# EAGLE schematic aleph-130509 (EAGLE 6.4)

## Sheet 1 of 9
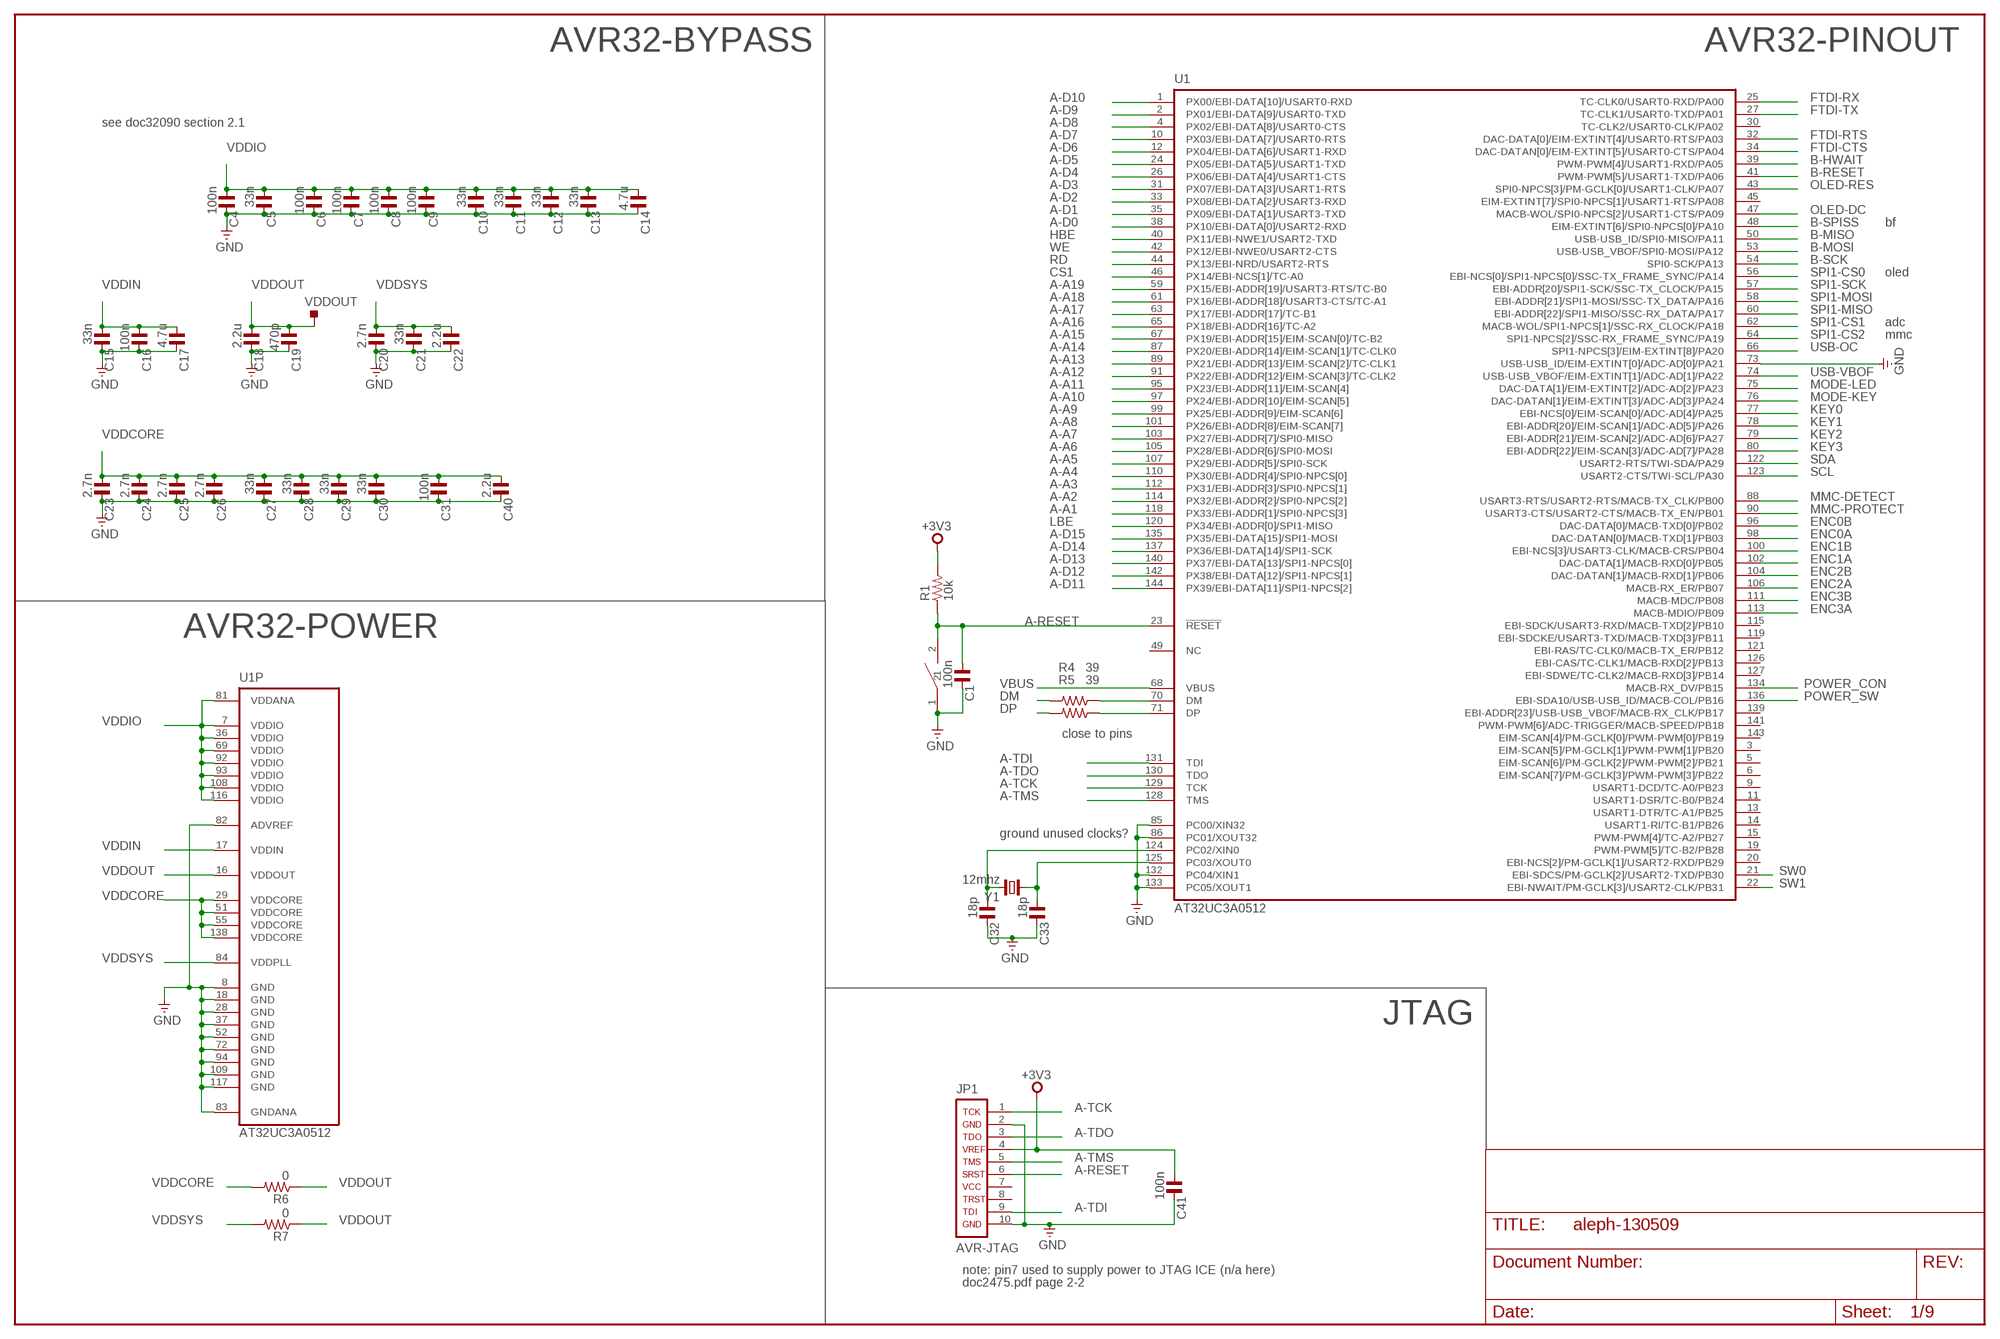
[diagram p0: schematic, sheet 1]

### Parts
C1  100n  C_0603  [C0603]
C4  100n  C_0603  [C0603]
C5  33n  C_0603  [C0603]
C6  100n  C_0603  [C0603]
C7  100n  C_0603  [C0603]
C8  100n  C_0603  [C0603]
C9  100n  C_0603  [C0603]
C10  33n  C_0603  [C0603]
C11  33n  C_0603  [C0603]
C12  33n  C_0603  [C0603]
C13  33n  C_0603  [C0603]
C14  4.7u  C_1206  [C1206]
C15  33n  C_0603  [C0603]
C16  100n  C_0603  [C0603]
C17  4.7u  C_1206  [C1206]
C18  2.2u  C_1206  [C1206]
C19  470p  C_0603  [C0603]
C20  2.7n  C_0603  [C0603]
C21  33n  C_0603  [C0603]
C22  2.2u  C_1206  [C1206]
C23  2.7n  C_0603  [C0603]
C24  2.7n  C_0603  [C0603]
C25  2.7n  C_0603  [C0603]
C26  2.7n  C_0603  [C0603]
C27  33n  C_0603  [C0603]
C28  33n  C_0603  [C0603]
C29  33n  C_0603  [C0603]
C30  33n  C_0603  [C0603]
C31  100n  C_0603  [C0603]
C32  18p  C_0603  [C0603]
C33  18p  C_0603  [C0603]
C40  2.2u  C_1206  [C1206]
C41  100n  C_0603  [C0603]
JP1  AVR-JTAG  AVR-JTAG-10  [AVR-JTAG-10]
R1  10k  R_0603  [R0603]
R4  39  R_0603  [R0603]
R5  39  R_0603  [R0603]
R6  0  R_0603  [R0603]
R7  0  R_0603  [R0603]
U1  AT32UC3A0512  AT32UC3A0128/0256/0512  [LQFP144]
U$1  PANASONIC-EVQ  [PANASONIC-EVQ]
VDDOUT  TPS-SMD-10R  [SMD-10R]
Y1  12mhz  CRYTALHC49UP  [HC49UP]

### Nets
+3V3: C41.1 JP1.4 R1.2 ; also sheet 2,3
A-A1: U1.118(PX33/EBI-ADDR[1]/SPI0-NPCS[3]) ; also sheet 2
A-A2: U1.114(PX32/EBI-ADDR[2]/SPI0-NPCS[2]) ; also sheet 2
A-A3: U1.112(PX31/EBI-ADDR[3]/SPI0-NPCS[1]) ; also sheet 2
A-A4: U1.110(PX30/EBI-ADDR[4]/SPI0-NPCS[0]) ; also sheet 2
A-A5: U1.107(PX29/EBI-ADDR[5]/SPI0-SCK) ; also sheet 2
A-A6: U1.105(PX28/EBI-ADDR[6]/SPI0-MOSI) ; also sheet 2
A-A7: U1.103(PX27/EBI-ADDR[7]/SPI0-MISO) ; also sheet 2
A-A8: U1.101(PX26/EBI-ADDR[8]/EIM-SCAN[7]) ; also sheet 2
A-A9: U1.99(PX25/EBI-ADDR[9]/EIM-SCAN[6]) ; also sheet 2
A-A10: U1.97(PX24/EBI-ADDR[10]/EIM-SCAN[5]) ; also sheet 2
A-A11: U1.95(PX23/EBI-ADDR[11]/EIM-SCAN[4]) ; also sheet 2
A-A12: U1.91(PX22/EBI-ADDR[12]/EIM-SCAN[3]/TC-CLK2) ; also sheet 2
A-A13: U1.89(PX21/EBI-ADDR[13]/EIM-SCAN[2]/TC-CLK1) ; also sheet 2
A-A14: U1.87(PX20/EBI-ADDR[14]/EIM-SCAN[1]/TC-CLK0) ; also sheet 2
A-A15: U1.67(PX19/EBI-ADDR[15]/EIM-SCAN[0]/TC-B2) ; also sheet 2
A-A16: U1.65(PX18/EBI-ADDR[16]/TC-A2) ; also sheet 2
A-A17: U1.63(PX17/EBI-ADDR[17]/TC-B1) ; also sheet 2
A-A18: U1.61(PX16/EBI-ADDR[18]/USART3-CTS/TC-A1) ; also sheet 2
A-A19: U1.59(PX15/EBI-ADDR[19]/USART3-RTS/TC-B0) ; also sheet 2
A-D0: U1.38(PX10/EBI-DATA[0]/USART2-RXD) ; also sheet 2
A-D1: U1.35(PX09/EBI-DATA[1]/USART3-TXD) ; also sheet 2
A-D2: U1.33(PX08/EBI-DATA[2]/USART3-RXD) ; also sheet 2
A-D3: U1.31(PX07/EBI-DATA[3]/USART1-RTS) ; also sheet 2
A-D4: U1.26(PX06/EBI-DATA[4]/USART1-CTS) ; also sheet 2
A-D5: U1.24(PX05/EBI-DATA[5]/USART1-TXD) ; also sheet 2
A-D6: U1.12(PX04/EBI-DATA[6]/USART1-RXD) ; also sheet 2
A-D7: U1.10(PX03/EBI-DATA[7]/USART0-RTS) ; also sheet 2
A-D8: U1.4(PX02/EBI-DATA[8]/USART0-CTS) ; also sheet 2
A-D9: U1.2(PX01/EBI-DATA[9]/USART0-TXD) ; also sheet 2
A-D10: U1.1(PX00/EBI-DATA[10]/USART0-RXD) ; also sheet 2
A-D11: U1.144(PX39/EBI-DATA[11]/SPI1-NPCS[2]) ; also sheet 2
A-D12: U1.142(PX38/EBI-DATA[12]/SPI1-NPCS[1]) ; also sheet 2
A-D13: U1.140(PX37/EBI-DATA[13]/SPI1-NPCS[0]) ; also sheet 2
A-D14: U1.137(PX36/EBI-DATA[14]/SPI1-SCK) ; also sheet 2
A-D15: U1.135(PX35/EBI-DATA[15]/SPI1-MOSI) ; also sheet 2
A-RESET: C1.1 JP1.6 R1.1 U1.23(!RESET) U$1.2
A-TCK: JP1.1 U1.129(TCK)
A-TDI: JP1.9 U1.131(TDI)
A-TDO: JP1.3 U1.130(TDO)
A-TMS: JP1.5 U1.128(TMS)
B-HWAIT: U1.39(PWM-PWM[4]/USART1-RXD/PA05) ; also sheet 4
B-MISO: U1.50(USB-USB_ID/SPI0-MISO/PA11) ; also sheet 4
B-MOSI: U1.53(USB-USB_VBOF/SPI0-MOSI/PA12) ; also sheet 4
B-RESET: U1.41(PWM-PWM[5]/USART1-TXD/PA06) ; also sheet 4
B-SCK: U1.54(SPI0-SCK/PA13) ; also sheet 4
B-SPISS: U1.48(EIM-EXTINT[6]/SPI0-NPCS[0]/PA10) ; also sheet 4
CS1: U1.46(PX14/EBI-NCS[1]/TC-A0) ; also sheet 2
DM: R4.2 ; also sheet 2
DP: R5.2 ; also sheet 2
ENC0A: U1.98(DAC-DATAN[0]/MACB-TXD[1]/PB03) ; also sheet 3
ENC0B: U1.96(DAC-DATA[0]/MACB-TXD[0]/PB02) ; also sheet 3
ENC1A: U1.102(DAC-DATA[1]/MACB-RXD[0]/PB05) ; also sheet 3
ENC1B: U1.100(EBI-NCS[3]/USART3-CLK/MACB-CRS/PB04) ; also sheet 3
ENC2A: U1.106(MACB-RX_ER/PB07) ; also sheet 3
ENC2B: U1.104(DAC-DATAN[1]/MACB-RXD[1]/PB06) ; also sheet 3
ENC3A: U1.113(MACB-MDIO/PB09) ; also sheet 3
ENC3B: U1.111(MACB-MDC/PB08) ; also sheet 3
FTDI-CTS: U1.34(DAC-DATAN[0]/EIM-EXTINT[5]/USART0-CTS/PA04) ; also sheet 2
FTDI-RTS: U1.32(DAC-DATA[0]/EIM-EXTINT[4]/USART0-RTS/PA03) ; also sheet 2
FTDI-RX: U1.25(TC-CLK0/USART0-RXD/PA00) ; also sheet 2
FTDI-TX: U1.27(TC-CLK1/USART0-TXD/PA01) ; also sheet 2
GND: C1.2 C4.2 C5.2 C6.2 C7.2 C8.2 C9.2 C10.2 C11.2 C12.2 C13.2 C14.2 C15.2 C16.2 C17.2 C18.2 C19.2 C20.2 C21.2 C22.2 C23.2 C24.2 C25.2 C26.2 C27.2 C28.2 C29.2 C30.2 C31.2 C32.2 C33.2 C40.2 C41.2 JP1.2 JP1.10 U1.8(GND) U1.18(GND) U1.28(GND) U1.37(GND) U1.52(GND) U1.72(GND) U1.73(USB-USB_ID/EIM-EXTINT[0]/ADC-AD[0]/PA21) U1.82(ADVREF) U1.83(GNDANA) U1.85(PC00/XIN32) U1.86(PC01/XOUT32) U1.94(GND) U1.109(GND) U1.117(GND) U1.132(PC04/XIN1) U1.133(PC05/XOUT1) U$1.1 ; also sheet 2,3,4,5
HBE: U1.40(PX11/EBI-NWE1/USART2-TXD) ; also sheet 2
KEY0: U1.77(EBI-NCS[0]/EIM-SCAN[0]/ADC-AD[4]/PA25) ; also sheet 3
KEY1: U1.78(EBI-ADDR[20]/EIM-SCAN[1]/ADC-AD[5]/PA26) ; also sheet 3
KEY2: U1.79(EBI-ADDR[21]/EIM-SCAN[2]/ADC-AD[6]/PA27) ; also sheet 3
KEY3: U1.80(EBI-ADDR[22]/EIM-SCAN[3]/ADC-AD[7]/PA28) ; also sheet 3
LBE: U1.120(PX34/EBI-ADDR[0]/SPI1-MISO) ; also sheet 2
MMC-DETECT: U1.88(USART3-RTS/USART2-RTS/MACB-TX_CLK/PB00) ; also sheet 2
MMC-PROTECT: U1.90(USART3-CTS/USART2-CTS/MACB-TX_EN/PB01) ; also sheet 2
MODE-KEY: U1.76(DAC-DATAN[1]/EIM-EXTINT[3]/ADC-AD[3]/PA24) ; also sheet 3
MODE-LED: U1.75(DAC-DATA[1]/EIM-EXTINT[2]/ADC-AD[2]/PA23) ; also sheet 3
N$4: C32.1 U1.124(PC02/XIN0) Y1.2
N$5: C33.1 U1.125(PC03/XOUT0) Y1.1
N$44: R4.1 U1.70(DM)
N$45: R5.1 U1.71(DP)
OLED-DC: U1.47(MACB-WOL/SPI0-NPCS[2]/USART1-CTS/PA09) ; also sheet 3
OLED-RES: U1.43(SPI0-NPCS[3]/PM-GCLK[0]/USART1-CLK/PA07) ; also sheet 3
POWER_CON: U1.134(MACB-RX_DV/PB15) ; also sheet 2
POWER_SW: U1.136(EBI-SDA10/USB-USB_ID/MACB-COL/PB16) ; also sheet 2
RD: U1.44(PX13/EBI-NRD/USART2-RTS) ; also sheet 2
SCL: U1.123(USART2-CTS/TWI-SCL/PA30) ; also sheet 3
SDA: U1.122(USART2-RTS/TWI-SDA/PA29) ; also sheet 3
SPI1-CS0: U1.56(EBI-NCS[0]/SPI1-NPCS[0]/SSC-TX_FRAME_SYNC/PA14) ; also sheet 3
SPI1-CS1: U1.62(MACB-WOL/SPI1-NPCS[1]/SSC-RX_CLOCK/PA18) ; also sheet 3
SPI1-CS2: U1.64(SPI1-NPCS[2]/SSC-RX_FRAME_SYNC/PA19) ; also sheet 2
SPI1-MISO: U1.60(EBI-ADDR[22]/SPI1-MISO/SSC-RX_DATA/PA17) ; also sheet 2,3
SPI1-MOSI: U1.58(EBI-ADDR[21]/SPI1-MOSI/SSC-TX_DATA/PA16) ; also sheet 2,3
SPI1-SCK: U1.57(EBI-ADDR[20]/SPI1-SCK/SSC-TX_CLOCK/PA15) ; also sheet 2,3
SW0: U1.21(EBI-SDCS/PM-GCLK[2]/USART2-TXD/PB30) ; also sheet 3
SW1: U1.22(EBI-NWAIT/PM-GCLK[3]/USART2-CLK/PB31) ; also sheet 3
USB-OC: U1.66(SPI1-NPCS[3]/EIM-EXTINT[8]/PA20) ; also sheet 2
USB-VBOF: U1.74(USB-USB_VBOF/EIM-EXTINT[1]/ADC-AD[1]/PA22) ; also sheet 2
VBUS: U1.68(VBUS) ; also sheet 2
VDDCORE: C23.1 C24.1 C25.1 C26.1 C27.1 C28.1 C29.1 C30.1 C31.1 C40.1 R6.2 U1.29(VDDCORE) U1.51(VDDCORE) U1.55(VDDCORE) U1.138(VDDCORE)
VDDIN: C15.1 C16.1 C17.1 U1.17(VDDIN) ; also sheet 2
VDDIO: C4.1 C5.1 C6.1 C7.1 C8.1 C9.1 C10.1 C11.1 C12.1 C13.1 C14.1 U1.7(VDDIO) U1.36(VDDIO) U1.69(VDDIO) U1.81(VDDANA) U1.92(VDDIO) U1.93(VDDIO) U1.108(VDDIO) U1.116(VDDIO) ; also sheet 2
VDDOUT: C18.1 C19.1 R6.1 R7.1 U1.16(VDDOUT) VDDOUT.TP
VDDSYS: C20.1 C21.1 C22.1 R7.2 U1.84(VDDPLL)
WE: U1.42(PX12/EBI-NWE0/USART2-CTS) ; also sheet 2
Unconnected: JP1.7 JP1.8 U1.3(EIM-SCAN[5]/PM-GCLK[1]/PWM-PWM[1]/PB20) U1.5(EIM-SCAN[6]/PM-GCLK[2]/PWM-PWM[2]/PB21) U1.6(EIM-SCAN[7]/PM-GCLK[3]/PWM-PWM[3]/PB22) U1.9(USART1-DCD/TC-A0/PB23) U1.11(USART1-DSR/TC-B0/PB24) U1.13(USART1-DTR/TC-A1/PB25) U1.14(USART1-RI/TC-B1/PB26) U1.15(PWM-PWM[4]/TC-A2/PB27) U1.19(PWM-PWM[5]/TC-B2/PB28) U1.20(EBI-NCS[2]/PM-GCLK[1]/USART2-RXD/PB29) U1.30(TC-CLK2/USART0-CLK/PA02) U1.45(EIM-EXTINT[7]/SPI0-NPCS[1]/USART1-RTS/PA08) U1.49(NC) U1.115(EBI-SDCK/USART3-RXD/MACB-TXD[2]/PB10) U1.119(EBI-SDCKE/USART3-TXD/MACB-TXD[3]/PB11) U1.121(EBI-RAS/TC-CLK0/MACB-TX_ER/PB12) U1.126(EBI-CAS/TC-CLK1/MACB-RXD[2]/PB13) U1.127(EBI-SDWE/TC-CLK2/MACB-RXD[3]/PB14) U1.139(EBI-ADDR[23]/USB-USB_VBOF/MACB-RX_CLK/PB17) U1.141(PWM-PWM[6]/ADC-TRIGGER/MACB-SPEED/PB18) U1.143(EIM-SCAN[4]/PM-GCLK[0]/PWM-PWM[0]/PB19)

### Notes on the sheet
- AVR32-BYPASS | AVR32-PINOUT
- see doc32090 section 2.1
- bf
- oled
- adc
- mmc
- AVR32-POWER
- close to pins
- ground unused clocks?
- JTAG
- note: pin7 used to supply power to JTAG ICE (n/a here)
- doc2475.pdf page 2-2

## Sheet 2 of 9
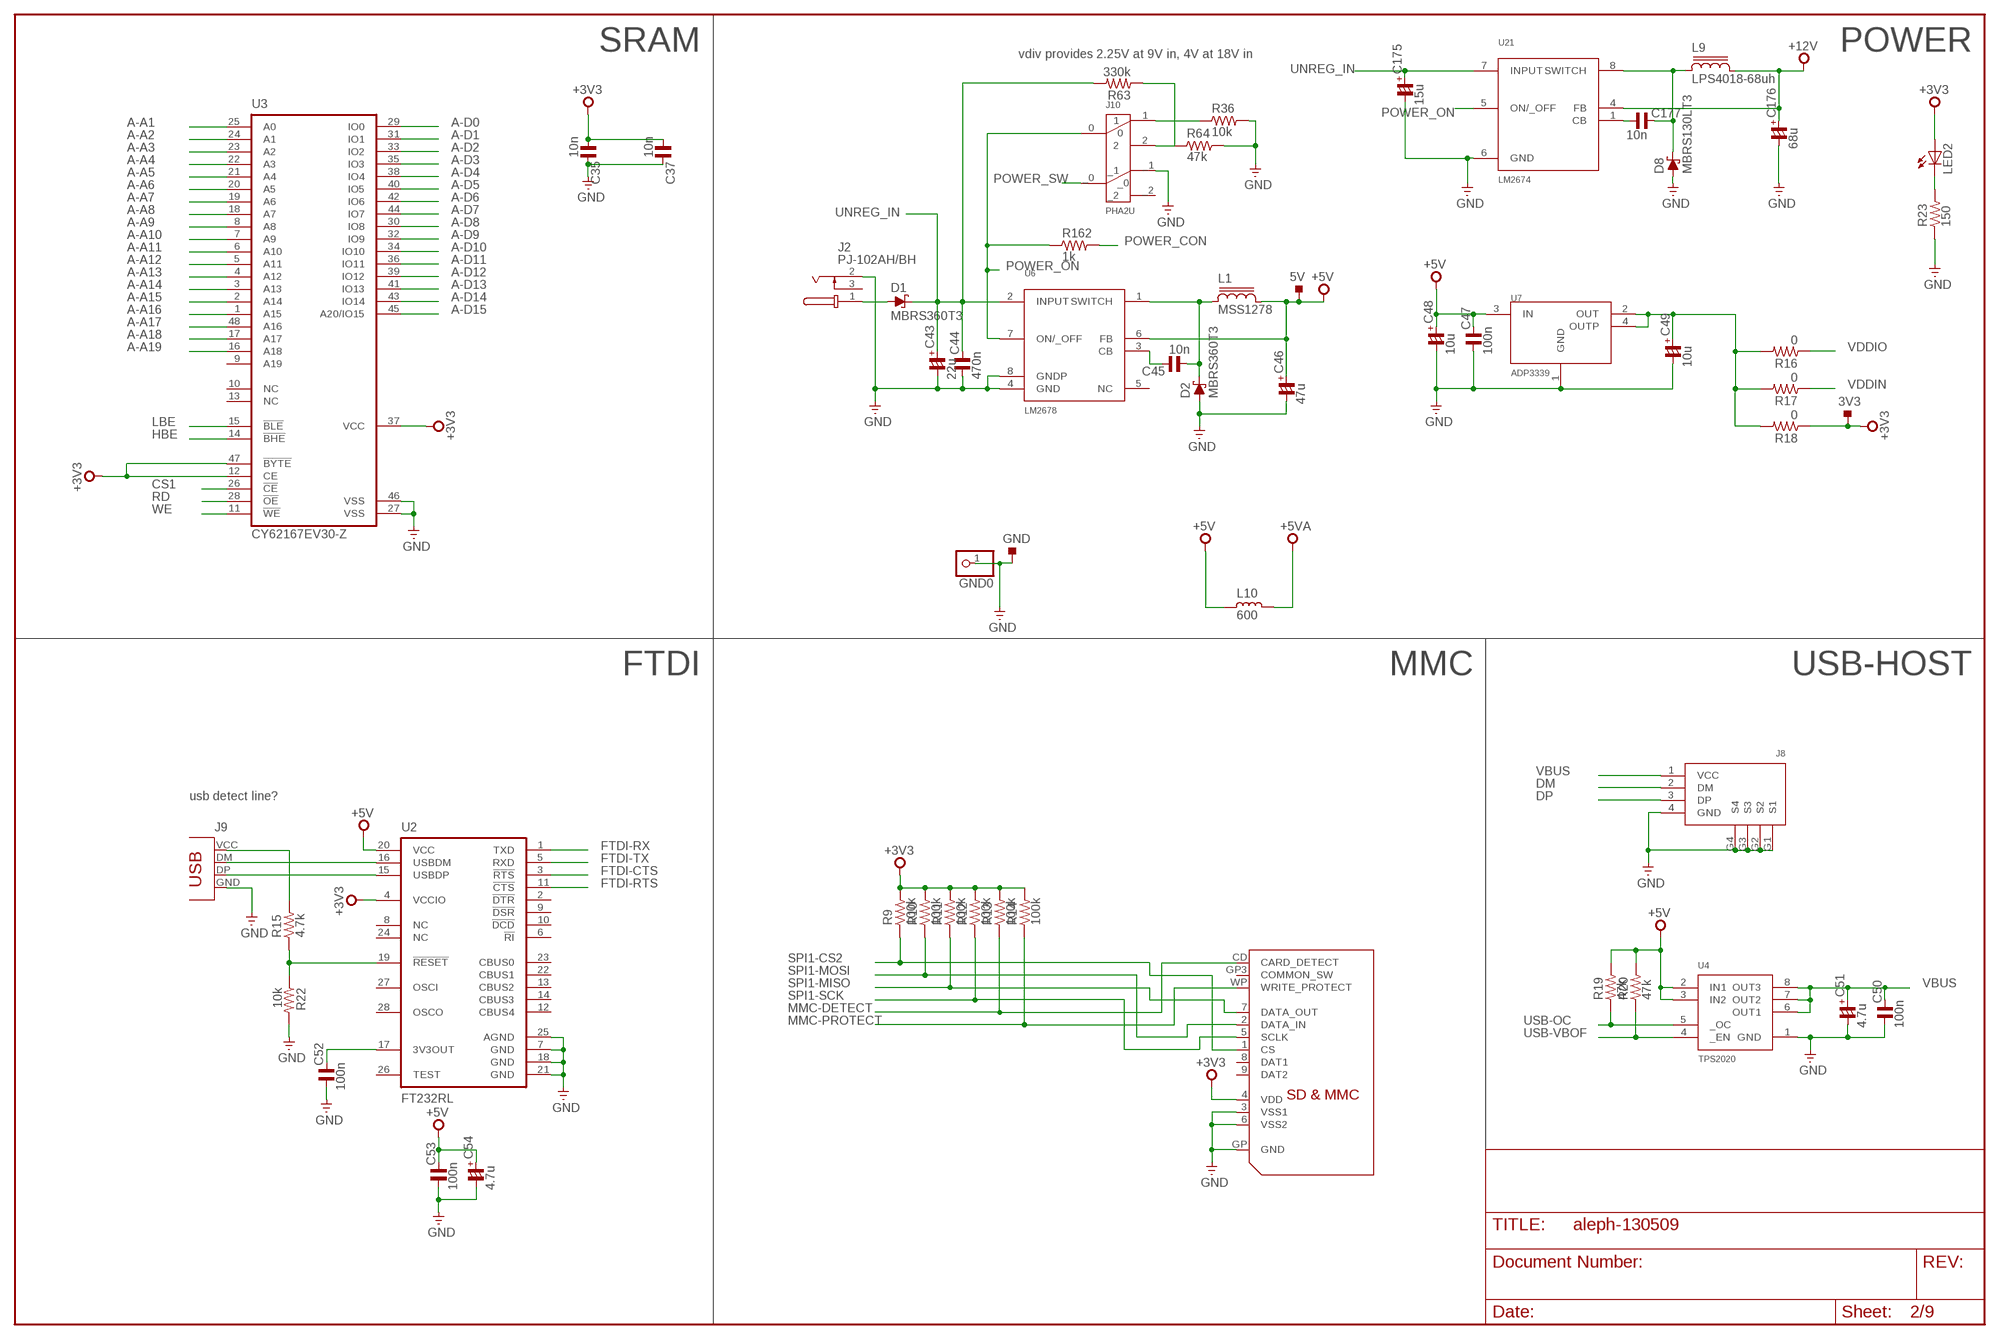
[diagram p1: schematic, sheet 2]

### Parts
3V3  TPS-SMD-15R  [SMD-15R]
5V  TPS-SMD-15R  [SMD-15R]
C35  10n  C_0603  [C0603]
C37  10n  C_0603  [C0603]
C43  22u  CP_1206/T  [C1206/T]
C44  470n  C_1206  [C1206]
C45  10n  C_1206  [C1206]
C46  47u  CP_3528  [C3528/T]
C47  100n  C_1206  [C1206]
C48  10u  CP_1206/T  [C1206/T]
C49  10u  CP_1206/T  [C1206/T]
C50  100n  C_0603  [C0603]
C51  4.7u  CP_1206/T  [C1206/T]
C52  100n  C_0603  [C0603]
C53  100n  C_0603  [C0603]
C54  4.7u  CP_1206/T  [C1206/T]
C175  15u  CP_6032  [C6032/T]
C176  68u  CP_7343  [C7343/T]
C177  10n  C_0603  [C0603]
D1  MBRS360T3  [SMC]
D2  MBRS360T3  [SMC]
D8  MBRS130LT3  [SMB403A]
GND  TPS-SMD-20R  [SMD-20R]
GND0  PINHD-1X1  [1X01]
J2  PJ-102AH/BH  [PJ-102XH]
J8  USBA-VERT  [USBA-VERT]
J9  USB_TYPE_B  [USB_B]
J10  PHA2U  [PHA2U]
L1  MSS1278  [MSS1278]
L9  LPS4018-68uh  LPS4018  [LPS4018]
L10  600  L_1206  [L1206]
LED2  LEDCHIPLED_1206  [CHIPLED_1206]
R9  100k  R_0603  [R0603]
R10  100k  R_0603  [R0603]
R11  100k  R_0603  [R0603]
R12  100k  R_0603  [R0603]
R13  100k  R_0603  [R0603]
R14  100k  R_0603  [R0603]
R15  4.7k  R_0603  [R0603]
R16  0  R_0603  [R0603]
R17  0  R_0603  [R0603]
R18  0  R_0603  [R0603]
R19  47k  R_0603  [R0603]
R20  47k  R_0603  [R0603]
R22  10k  R_0603  [R0603]
R23  150  R_0603  [R0603]
R36  10k  R_0603  [R0603]
R63  330k  R_0603  [R0603]
R64  47k  R_0603  [R0603]
R162  1k  R_0603  [R0603]
U2  FT232RL  [SSOP28]
U3  CY62167EV30-Z  [TSOP48]
U4  TPS2020  [SO08]
U6  LM2678  [TO263-7]
U7  ADP3339  [SOT223]
U21  LM2674  [SO08]
U$6  SDMMC06132  [06132]

### Nets
+3V3: 3V3.TP C35.1 C37.1 LED2.A R9.2 R10.2 R11.2 R12.2 R13.2 R14.2 R18.1 U2.4(VCCIO) U3.12(CE) U3.37(VCC) U3.47(!BYTE!) U$6.4(VDD) ; also sheet 1,3
+5V: 5V.TP C46.+ C47.2 C48.+ C53.2 C54.+ L1.2 L10.2 R19.2 R20.2 U2.20(VCC) U4.2(IN1) U4.3(IN2) U6.6(FB) U7.3(IN) ; also sheet 3,4,6
+5VA: L10.1 ; also sheet 3,7,9
+12V: C176.+ L9.2 U21.4(FB) ; also sheet 3,6
A-A1: U3.25(A0) ; also sheet 1
A-A2: U3.24(A1) ; also sheet 1
A-A3: U3.23(A2) ; also sheet 1
A-A4: U3.22(A3) ; also sheet 1
A-A5: U3.21(A4) ; also sheet 1
A-A6: U3.20(A5) ; also sheet 1
A-A7: U3.19(A6) ; also sheet 1
A-A8: U3.18(A7) ; also sheet 1
A-A9: U3.8(A8) ; also sheet 1
A-A10: U3.7(A9) ; also sheet 1
A-A11: U3.6(A10) ; also sheet 1
A-A12: U3.5(A11) ; also sheet 1
A-A13: U3.4(A12) ; also sheet 1
A-A14: U3.3(A13) ; also sheet 1
A-A15: U3.2(A14) ; also sheet 1
A-A16: U3.1(A15) ; also sheet 1
A-A17: U3.48(A16) ; also sheet 1
A-A18: U3.17(A17) ; also sheet 1
A-A19: U3.16(A18) ; also sheet 1
A-D0: U3.29(IO0) ; also sheet 1
A-D1: U3.31(IO1) ; also sheet 1
A-D2: U3.33(IO2) ; also sheet 1
A-D3: U3.35(IO3) ; also sheet 1
A-D4: U3.38(IO4) ; also sheet 1
A-D5: U3.40(IO5) ; also sheet 1
A-D6: U3.42(IO6) ; also sheet 1
A-D7: U3.44(IO7) ; also sheet 1
A-D8: U3.30(IO8) ; also sheet 1
A-D9: U3.32(IO9) ; also sheet 1
A-D10: U3.34(IO10) ; also sheet 1
A-D11: U3.36(IO11) ; also sheet 1
A-D12: U3.39(IO12) ; also sheet 1
A-D13: U3.41(IO13) ; also sheet 1
A-D14: U3.43(IO14) ; also sheet 1
A-D15: U3.45(A20/IO15) ; also sheet 1
CS1: U3.26(!CE!) ; also sheet 1
DM: J8.2(DM) ; also sheet 1
DP: J8.3(DP) ; also sheet 1
FTDI-CTS: U2.3(!RTS!) ; also sheet 1
FTDI-RTS: U2.11(!CTS!) ; also sheet 1
FTDI-RX: U2.1(TXD) ; also sheet 1
FTDI-TX: U2.5(RXD) ; also sheet 1
GND: C35.2 C37.2 C43.- C44.1 C46.- C47.1 C48.- C49.- C50.1 C51.- C52.1 C53.1 C54.- C175.- C176.- D2.A D8.A GND0.1 GND.TP J2.2(S) J8.4(GND) J8.G1(S1) J8.G2(S2) J8.G3(S3) J8.G4(S4) J9.GND J10._1 R22.2 R23.1 R36.2 R64.2 U2.7(GND) U2.18(GND) U2.21(GND) U2.25(AGND) U3.27(VSS) U3.46(VSS) U4.1(GND) U6.4(GND) U6.8(GNDP) U7.1(GND) U21.6(GND) U$6.3(VSS1) U$6.6(VSS2) U$6.GP(GND) ; also sheet 1,3,4,5
HBE: U3.14(!BHE!) ; also sheet 1
LBE: U3.15(!BLE!) ; also sheet 1
MMC-DETECT: R13.1 U$6.CD(CARD_DETECT) ; also sheet 1
MMC-PROTECT: R14.1 U$6.WP(WRITE_PROTECT) ; also sheet 1
N$3: D1.A J2.1(T)
N$6: R15.1 R22.1 U2.19(!RESET!)
N$7: C45.1 D2.C L1.1 U6.1(SWITCH)
N$9: C45.2 U6.3(CB)
N$12: J9.DM(USBDM) U2.16(USBDM)
N$13: J9.DP(USBDP) U2.15(USBDP)
N$14: C52.2 U2.17(3V3OUT)
N$15: LED2.C R23.2
N$17: J9.VCC R15.2
N$32: C49.+ R16.2 R17.2 R18.2 U7.2(OUT) U7.4(OUTP)
N$50: J10.1 R36.1
N$55: J10.2 R63.1 R64.1
N$133: C177.1 U21.1(CB)
N$134: C177.2 D8.C L9.1 U21.8(SWITCH)
POWER_CON: R162.2 ; also sheet 1
POWER_ON: J10.0 R162.1 U6.7(ON/_OFF) U21.5(ON/_OFF)
POWER_SW: J10._0 ; also sheet 1
RD: U3.28(!OE!) ; also sheet 1
SPI1-CS2: R9.1 U$6.1(CS) ; also sheet 1
SPI1-MISO: R11.1 U$6.7(DATA_OUT) ; also sheet 1,3
SPI1-MOSI: R10.1 U$6.2(DATA_IN) ; also sheet 1,3
SPI1-SCK: R12.1 U$6.5(SCLK) ; also sheet 1,3
UNREG_IN: C43.+ C44.2 C175.+ D1.C R63.2 U6.2(INPUT) U21.7(INPUT)
USB-OC: R19.1 U4.5(_OC) ; also sheet 1
USB-VBOF: R20.1 U4.4(_EN) ; also sheet 1
VBUS: C50.2 C51.+ J8.1(VCC) U4.6(OUT1) U4.7(OUT2) U4.8(OUT3) ; also sheet 1
VDDIN: R17.1 ; also sheet 1
VDDIO: R16.1 ; also sheet 1
WE: U3.11(!WE!) ; also sheet 1
Unconnected: J2.3(SS) J10._2 U2.2(!DTR!) U2.6(!RI!) U2.8(NC) U2.9(!DSR!) U2.10(!DCD!) U2.12(CBUS4) U2.13(CBUS2) U2.14(CBUS3) U2.22(CBUS1) U2.23(CBUS0) U2.24(NC) U2.26(TEST) U2.27(OSCI) U2.28(OSCO) U3.9(A19) U3.10(NC) U3.13(NC) U6.5(NC) U$6.8(DAT1) U$6.9(DAT2) U$6.GP3(COMMON_SW)

### Notes on the sheet
- SRAM | POWER
- vdiv provides 2.25V at 9V in, 4V at 18V in
- FTDI | MMC | USB-HOST
- usb detect line?

## Sheet 3 of 9
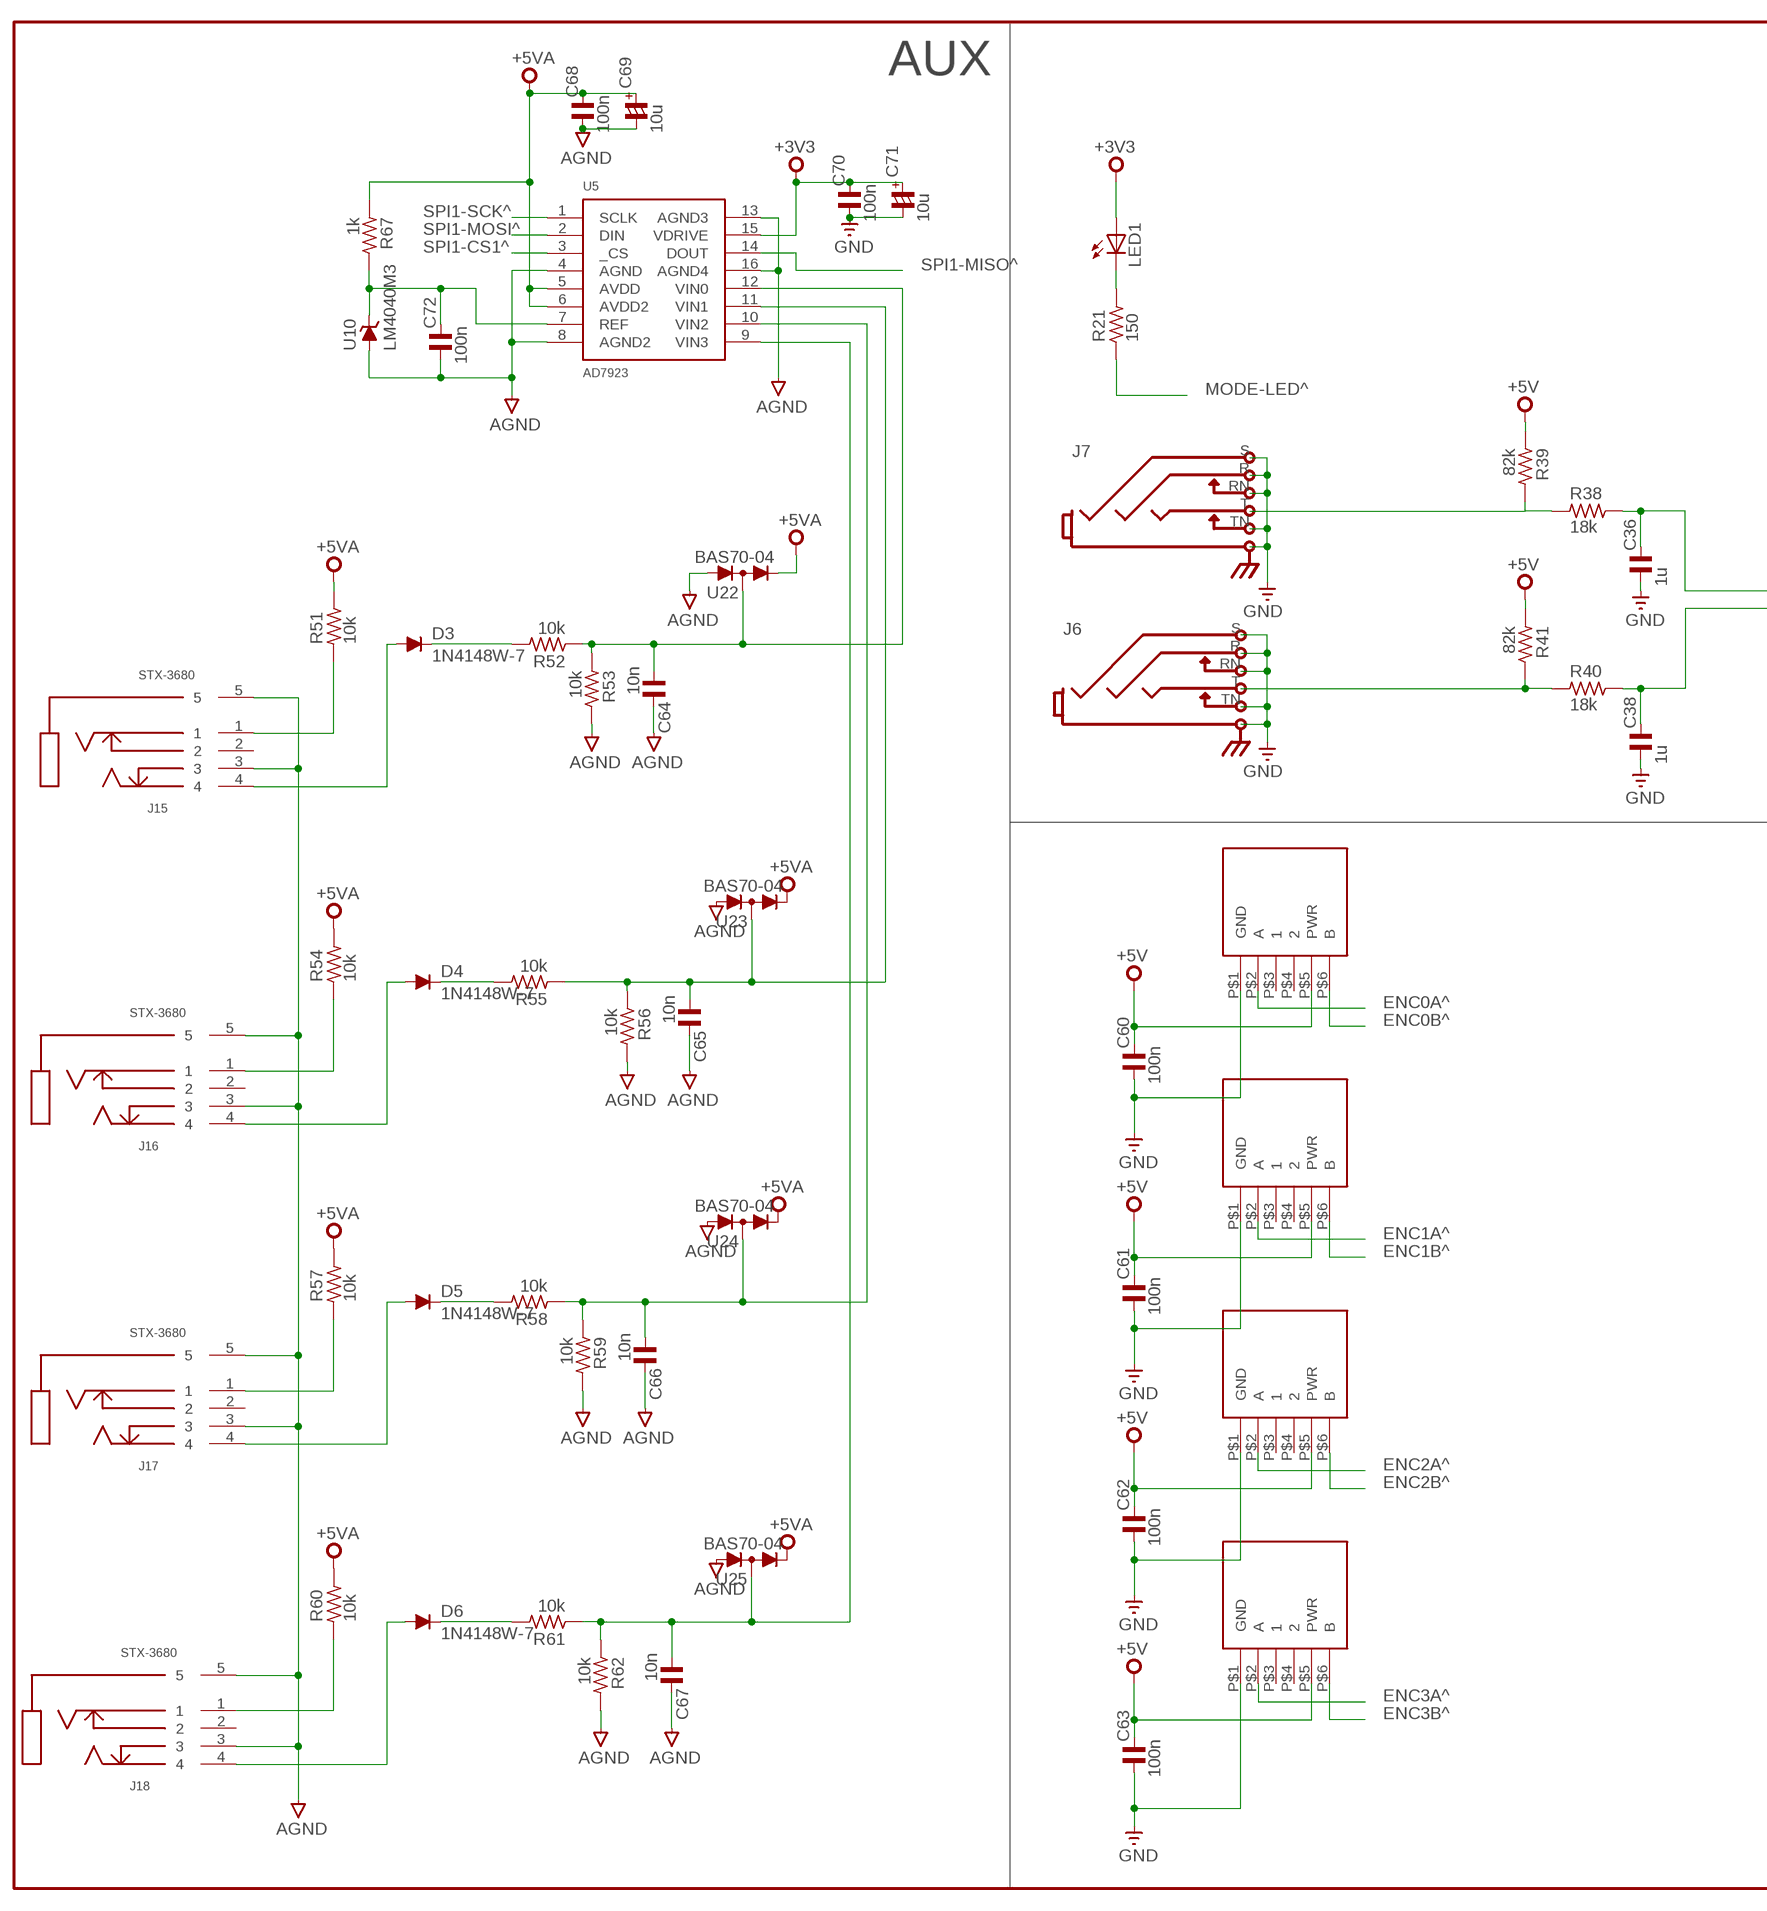
[diagram p2: schematic, sheet 3, part 1 of 2]
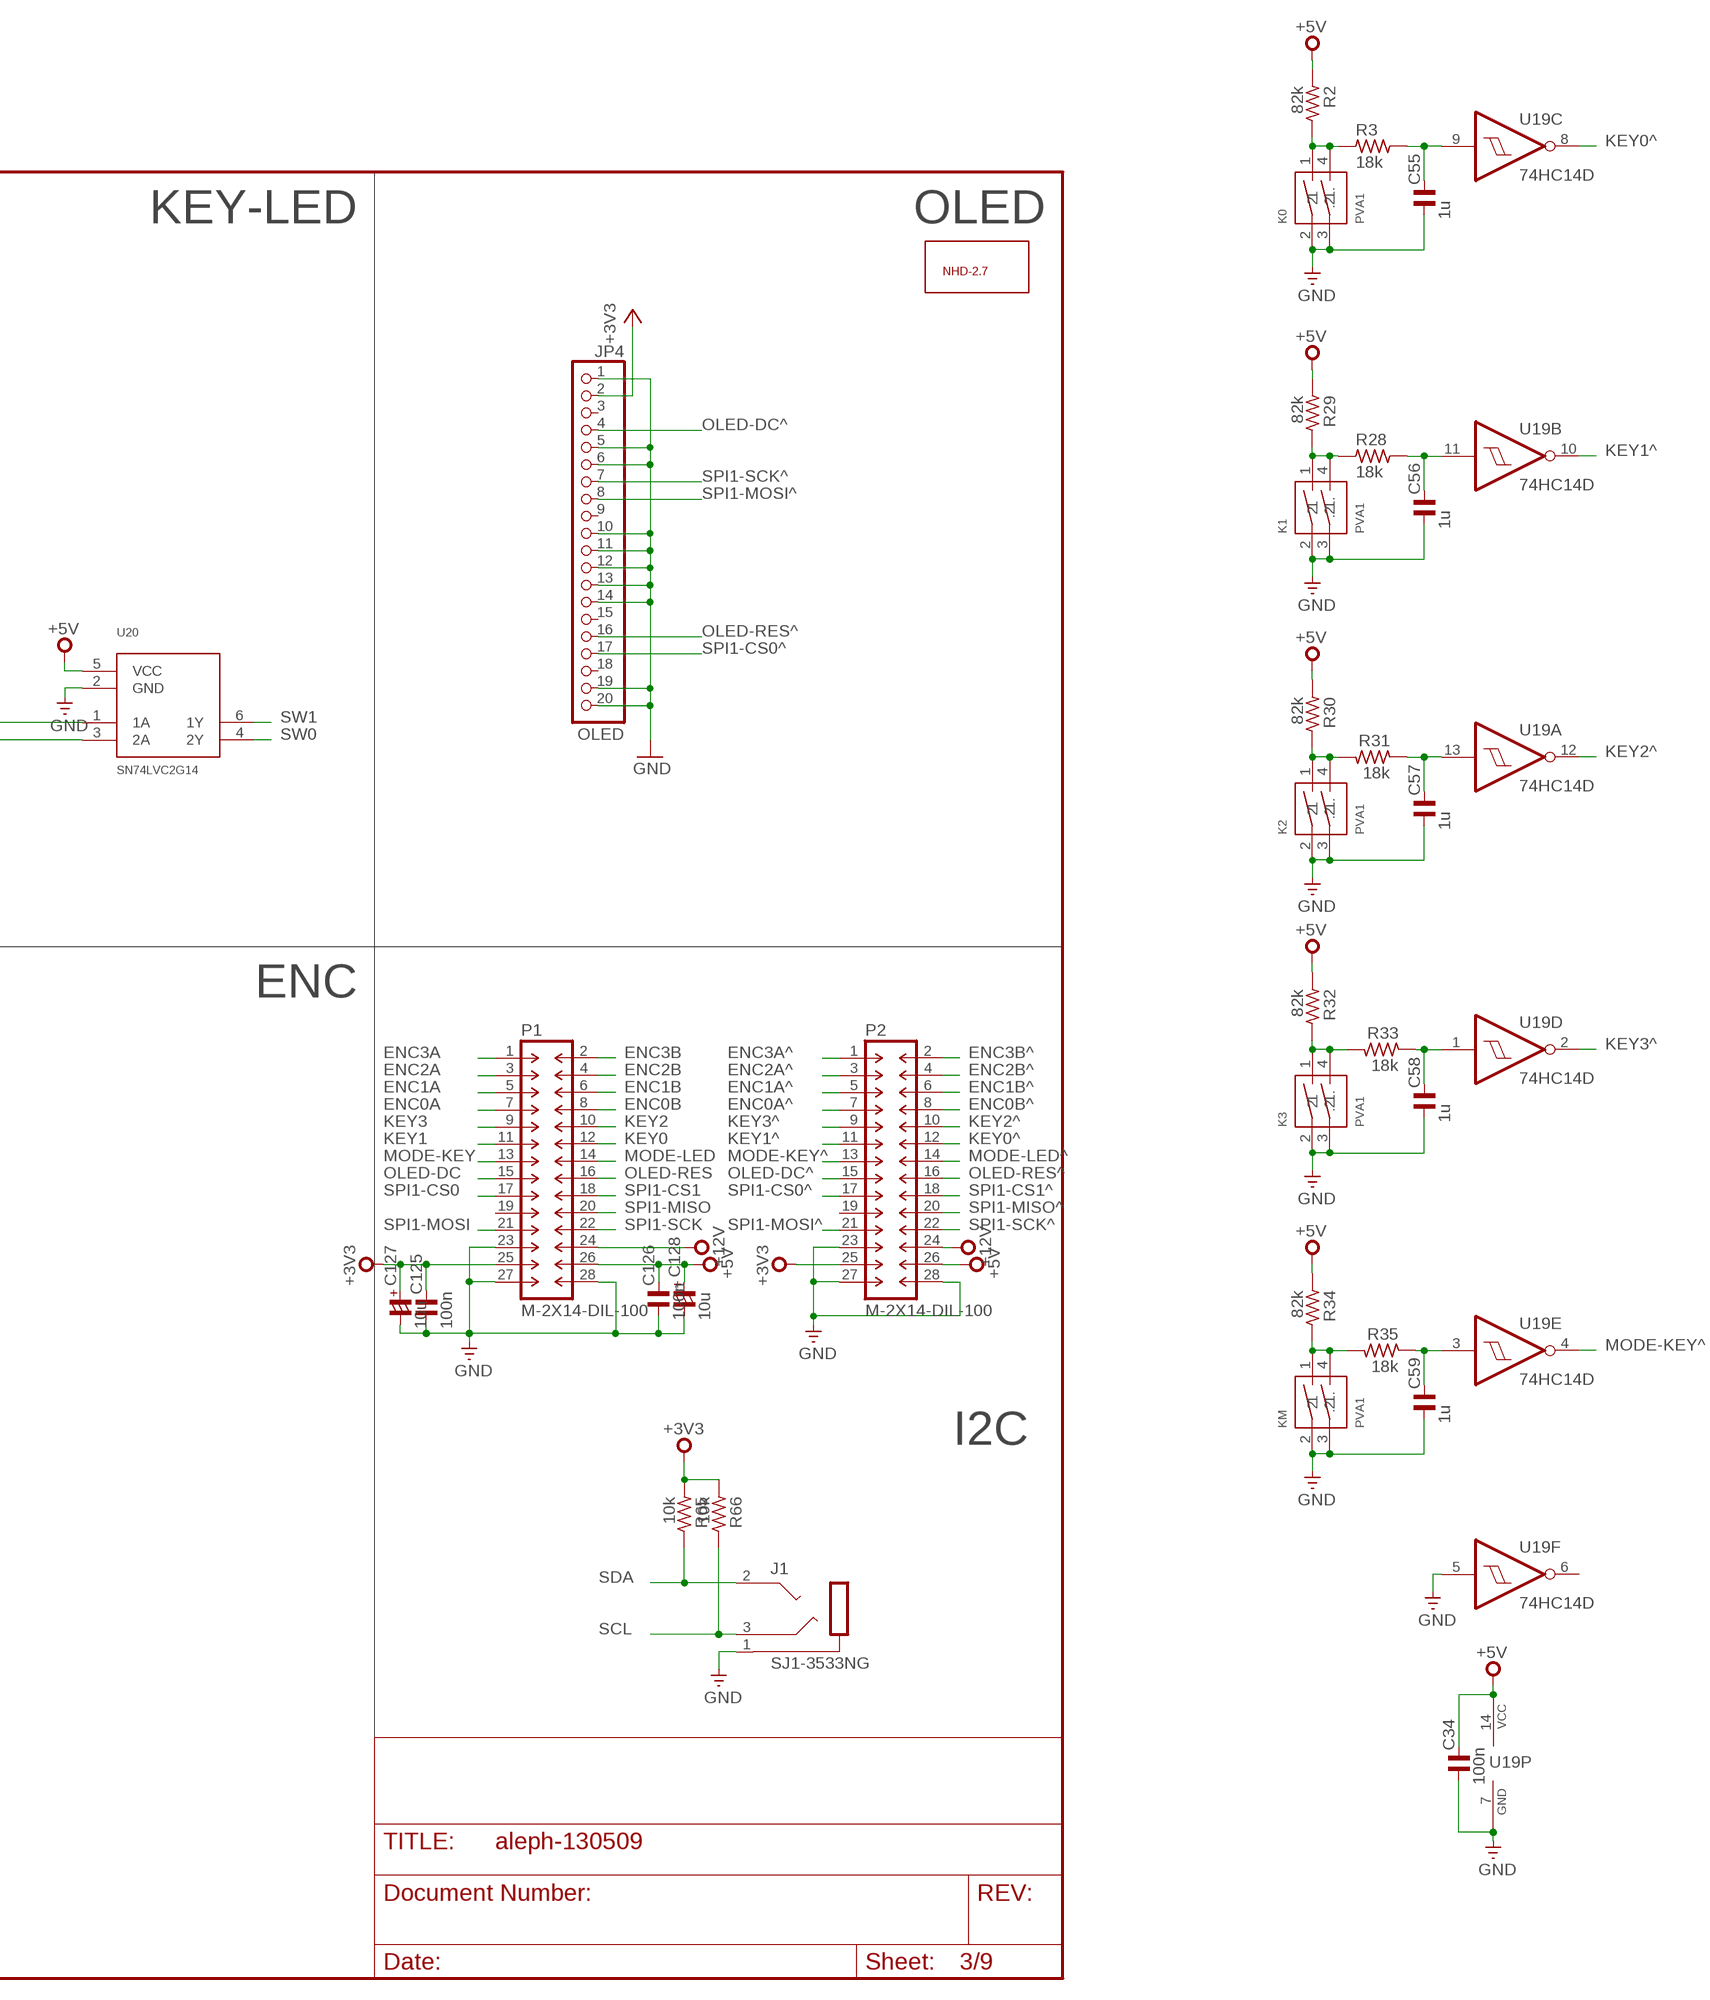
[diagram p3: schematic, sheet 3, part 2 of 2]

### Parts
C34  100n  C_0603  [C0603]
C36  1u  C_0603  [C0603]
C38  1u  C_0603  [C0603]
C55  1u  C_0603  [C0603]
C56  1u  C_0603  [C0603]
C57  1u  C_0603  [C0603]
C58  1u  C_0603  [C0603]
C59  1u  C_0603  [C0603]
C60  100n  C_0603  [C0603]
C61  100n  C_0603  [C0603]
C62  100n  C_0603  [C0603]
C63  100n  C_0603  [C0603]
C64  10n  C_0603  [C0603]
C65  10n  C_0603  [C0603]
C66  10n  C_0603  [C0603]
C67  10n  C_0603  [C0603]
C68  100n  C_0603  [C0603]
C69  10u  CP_1206/T  [C1206/T]
C70  100n  C_0603  [C0603]
C71  10u  CP_1206/T  [C1206/T]
C72  100n  C_0603  [C0603]
C125  100n  C_0603  [C0603]
C126  100n  C_0603  [C0603]
C127  10u  CP_1206/T  [C1206/T]
C128  10u  CP_1206/T  [C1206/T]
D3  1N4148W-7  [SOD123]
D4  1N4148W-7  [SOD123]
D5  1N4148W-7  [SOD123]
D6  1N4148W-7  [SOD123]
J1  SJ1-3533NG  [SJ1-3533NG]
J6  STEREOSW2GND  [NEUTRIK-NRJ6HM-1]
J7  STEREOSW2GND  [NEUTRIK-NRJ6HM-1]
J15  STX-3680  [STX-3680]
J16  STX-3680  [STX-3680]
J17  STX-3680  [STX-3680]
J18  STX-3680  [STX-3680]
JP4  OLED  PINHD-1X20  [1X20]
K0  PVA1  [PVA1]
K1  PVA1  [PVA1]
K2  PVA1  [PVA1]
K3  PVA1  [PVA1]
KM  PVA1  [PVA1]
LED1  LEDCHIPLED_1206  [CHIPLED_1206]
P1  M-2X14-DIL-100  [DIL-100-2X14]
P2  M-2X14-DIL-100  [DIL-100-2X14]
R2  82k  R_0603  [R0603]
R3  18k  R_0603  [R0603]
R21  150  R_0603  [R0603]
R28  18k  R_0603  [R0603]
R29  82k  R_0603  [R0603]
R30  82k  R_0603  [R0603]
R31  18k  R_0603  [R0603]
R32  82k  R_0603  [R0603]
R33  18k  R_0603  [R0603]
R34  82k  R_0603  [R0603]
R35  18k  R_0603  [R0603]
R38  18k  R_0603  [R0603]
R39  82k  R_0603  [R0603]
R40  18k  R_0603  [R0603]
R41  82k  R_0603  [R0603]
R51  10k  R_0603  [R0603]
R52  10k  R_0603  [R0603]
R53  10k  R_0603  [R0603]
R54  10k  R_0603  [R0603]
R55  10k  R_0603  [R0603]
R56  10k  R_0603  [R0603]
R57  10k  R_0603  [R0603]
R58  10k  R_0603  [R0603]
R59  10k  R_0603  [R0603]
R60  10k  R_0603  [R0603]
R61  10k  R_0603  [R0603]
R62  10k  R_0603  [R0603]
R65  10k  R_0603  [R0603]
R66  10k  R_0603  [R0603]
R67  1k  R_0603  [R0603]
U5  AD7923  [TSSOP16]
U10  LM4040M3  [SOT23]
U19  74HC14D  [SO14]
U20  SN74LVC2G14  [SOT23-6]
U22  BAS70-04  [SOT23]
U23  BAS70-04  [SOT23]
U24  BAS70-04  [SOT23]
U25  BAS70-04  [SOT23]
U$2  BOURNS-EM14  [BOURNS-EM14]
U$3  BOURNS-EM14  [BOURNS-EM14]
U$4  BOURNS-EM14  [BOURNS-EM14]
U$5  BOURNS-EM14  [BOURNS-EM14]
U$10  NHD-2.7  [NHD-2.7]

### Nets
+3V3: C70.2 C71.+ C125.2 C127.+ JP4.2 LED1.A P1.25 P2.25 R65.1 R66.1 U5.15(VDRIVE) ; also sheet 1,2
+5V: C34.2 C60.2 C61.2 C62.2 C63.2 C126.2 C128.+ P1.26 P2.26 R2.1 R29.1 R30.1 R32.1 R34.1 R39.1 R41.1 U19.14(P:VCC) U20.5(VCC) U$2.P$5(PWR) U$3.P$5(PWR) U$4.P$5(PWR) U$5.P$5(PWR) ; also sheet 2,4,6
+5VA: C68.2 C69.+ R51.2 R54.2 R57.2 R60.2 R67.1 U5.5(AVDD) U5.6(AVDD2) U22.2(C) U23.2(C) U24.2(C) U25.2(C) ; also sheet 2,7,9
+12V: P1.24 P2.24 ; also sheet 2,6
AGND: C64.2 C65.2 C66.2 C67.2 C68.1 C69.- C72.1 J15.3 J15.5 J16.3 J16.5 J17.3 J17.5 J18.3 J18.5 R53.2 R56.2 R59.2 R62.2 U5.4(AGND) U5.8(AGND2) U5.13(AGND3) U5.16(AGND4) U10.2(A) U22.1(A) U23.1(A) U24.1(A) U25.1(A) ; also sheet 5,6,7,8,9
ENC0A: P1.7 ; also sheet 1
ENC0A^: P2.7 U$2.P$2(A)
ENC0B: P1.8 ; also sheet 1
ENC0B^: P2.8 U$2.P$6(B)
ENC1A: P1.5 ; also sheet 1
ENC1A^: P2.5 U$3.P$2(A)
ENC1B: P1.6 ; also sheet 1
ENC1B^: P2.6 U$3.P$6(B)
ENC2A: P1.3 ; also sheet 1
ENC2A^: P2.3 U$4.P$2(A)
ENC2B: P1.4 ; also sheet 1
ENC2B^: P2.4 U$4.P$6(B)
ENC3A: P1.1 ; also sheet 1
ENC3A^: P2.1 U$5.P$2(A)
ENC3B: P1.2 ; also sheet 1
ENC3B^: P2.2 U$5.P$6(B)
GND: C34.1 C36.1 C38.1 C55.1 C56.1 C57.1 C58.1 C59.1 C60.1 C61.1 C62.1 C63.1 C70.1 C71.- C125.1 C126.1 C127.- C128.- J1.1(S) J6.R J6.RN J6.S J6.TN J7.R J7.RN J7.S J7.TN JP4.1 JP4.5 JP4.6 JP4.10 JP4.11 JP4.12 JP4.13 JP4.14 JP4.19 JP4.20 K0.2 K0.3(1.) K1.2 K1.3(1.) K2.2 K2.3(1.) K3.2 K3.3(1.) KM.2 KM.3(1.) P1.23 P1.27 P1.28 P2.23 P2.27 P2.28 U19.5(F:I) U19.7(P:GND) U20.2(GND) U$2.P$1(GND) U$3.P$1(GND) U$4.P$1(GND) U$5.P$1(GND) ; also sheet 1,2,4,5
KEY0: P1.12 ; also sheet 1
KEY0^: P2.12 U19.8(C:O)
KEY1: P1.11 ; also sheet 1
KEY1^: P2.11 U19.10(B:O)
KEY2: P1.10 ; also sheet 1
KEY2^: P2.10 U19.12(A:O)
KEY3: P1.9 ; also sheet 1
KEY3^: P2.9 U19.2(D:O)
MODE-KEY: P1.13 ; also sheet 1
MODE-KEY^: P2.13 U19.4(E:O)
MODE-LED: P1.14 ; also sheet 1
MODE-LED^: P2.14 R21.1
N$2: K0.1 K0.4(.2) R2.2 R3.1
N$8: C55.2 R3.2 U19.9(C:I)
N$10: K1.1 K1.4(.2) R28.1 R29.2
N$11: C56.2 R28.2 U19.11(B:I)
N$20: LED1.C R21.2
N$21: K2.1 K2.4(.2) R30.2 R31.2
N$23: C57.2 R31.1 U19.13(A:I)
N$27: K3.1 K3.4(.2) R32.2 R33.2
N$30: C58.2 R33.1 U19.1(D:I)
N$33: J17.1 R57.1
N$34: D3.A J15.4
N$37: D4.C R55.2
N$39: D3.C R52.2
N$40: D5.C R58.2
N$41: J16.1 R54.1
N$42: D4.A J16.4
N$43: KM.1 KM.4(.2) R34.2 R35.2
N$46: D6.C R61.2
N$47: J15.1 R51.1
N$48: D5.A J17.4
N$49: C59.2 R35.1 U19.3(E:I)
N$51: J18.1 R60.1
N$52: D6.A J18.4
N$54: C38.2 R40.2 U20.3(2A)
N$58: C72.2 R67.2 U5.7(REF) U10.1(C)
N$116: C65.1 R55.1 R56.1 U5.11(VIN1) U23.3(AC)
N$117: C66.1 R58.1 R59.1 U5.10(VIN2) U24.3(AC)
N$118: C67.1 R61.1 R62.1 U5.9(VIN3) U25.3(AC)
N$119: C64.1 R52.1 R53.1 U5.12(VIN0) U22.3(AC)
N$124: C36.2 R38.2 U20.1(1A)
OLED-DC: P1.15 ; also sheet 1
OLED-DC^: JP4.4 P2.15
OLED-RES: P1.16 ; also sheet 1
OLED-RES^: JP4.16 P2.16
SCL: J1.3(R) R66.2 ; also sheet 1
SDA: J1.2(T) R65.2 ; also sheet 1
SPI1-CS0: P1.17 ; also sheet 1
SPI1-CS0^: JP4.17 P2.17
SPI1-CS1: P1.18 ; also sheet 1
SPI1-CS1^: P2.18 U5.3(_CS)
SPI1-MISO: P1.20 ; also sheet 1,2
SPI1-MISO^: P2.20 U5.14(DOUT)
SPI1-MOSI: P1.21 ; also sheet 1,2
SPI1-MOSI^: JP4.8 P2.21 U5.2(DIN)
SPI1-SCK: P1.22 ; also sheet 1,2
SPI1-SCK^: JP4.7 P2.22 U5.1(SCLK)
SW0: U20.4(2Y) ; also sheet 1
SW0CON^: J7.T R38.1 R39.2
SW1: U20.6(1Y) ; also sheet 1
SW1CON^: J6.T R40.1 R41.2
Unconnected: J15.2 J16.2 J17.2 J18.2 JP4.3 JP4.9 JP4.15 JP4.18 P1.19 P2.19 U19.6(F:O) U$2.P$3 U$2.P$4 U$3.P$3 U$3.P$4 U$4.P$3 U$4.P$4 U$5.P$3 U$5.P$4

### Notes on the sheet
- AUX | KEY-LED | OLED
- ENC
- I2C

## Sheet 4 of 9
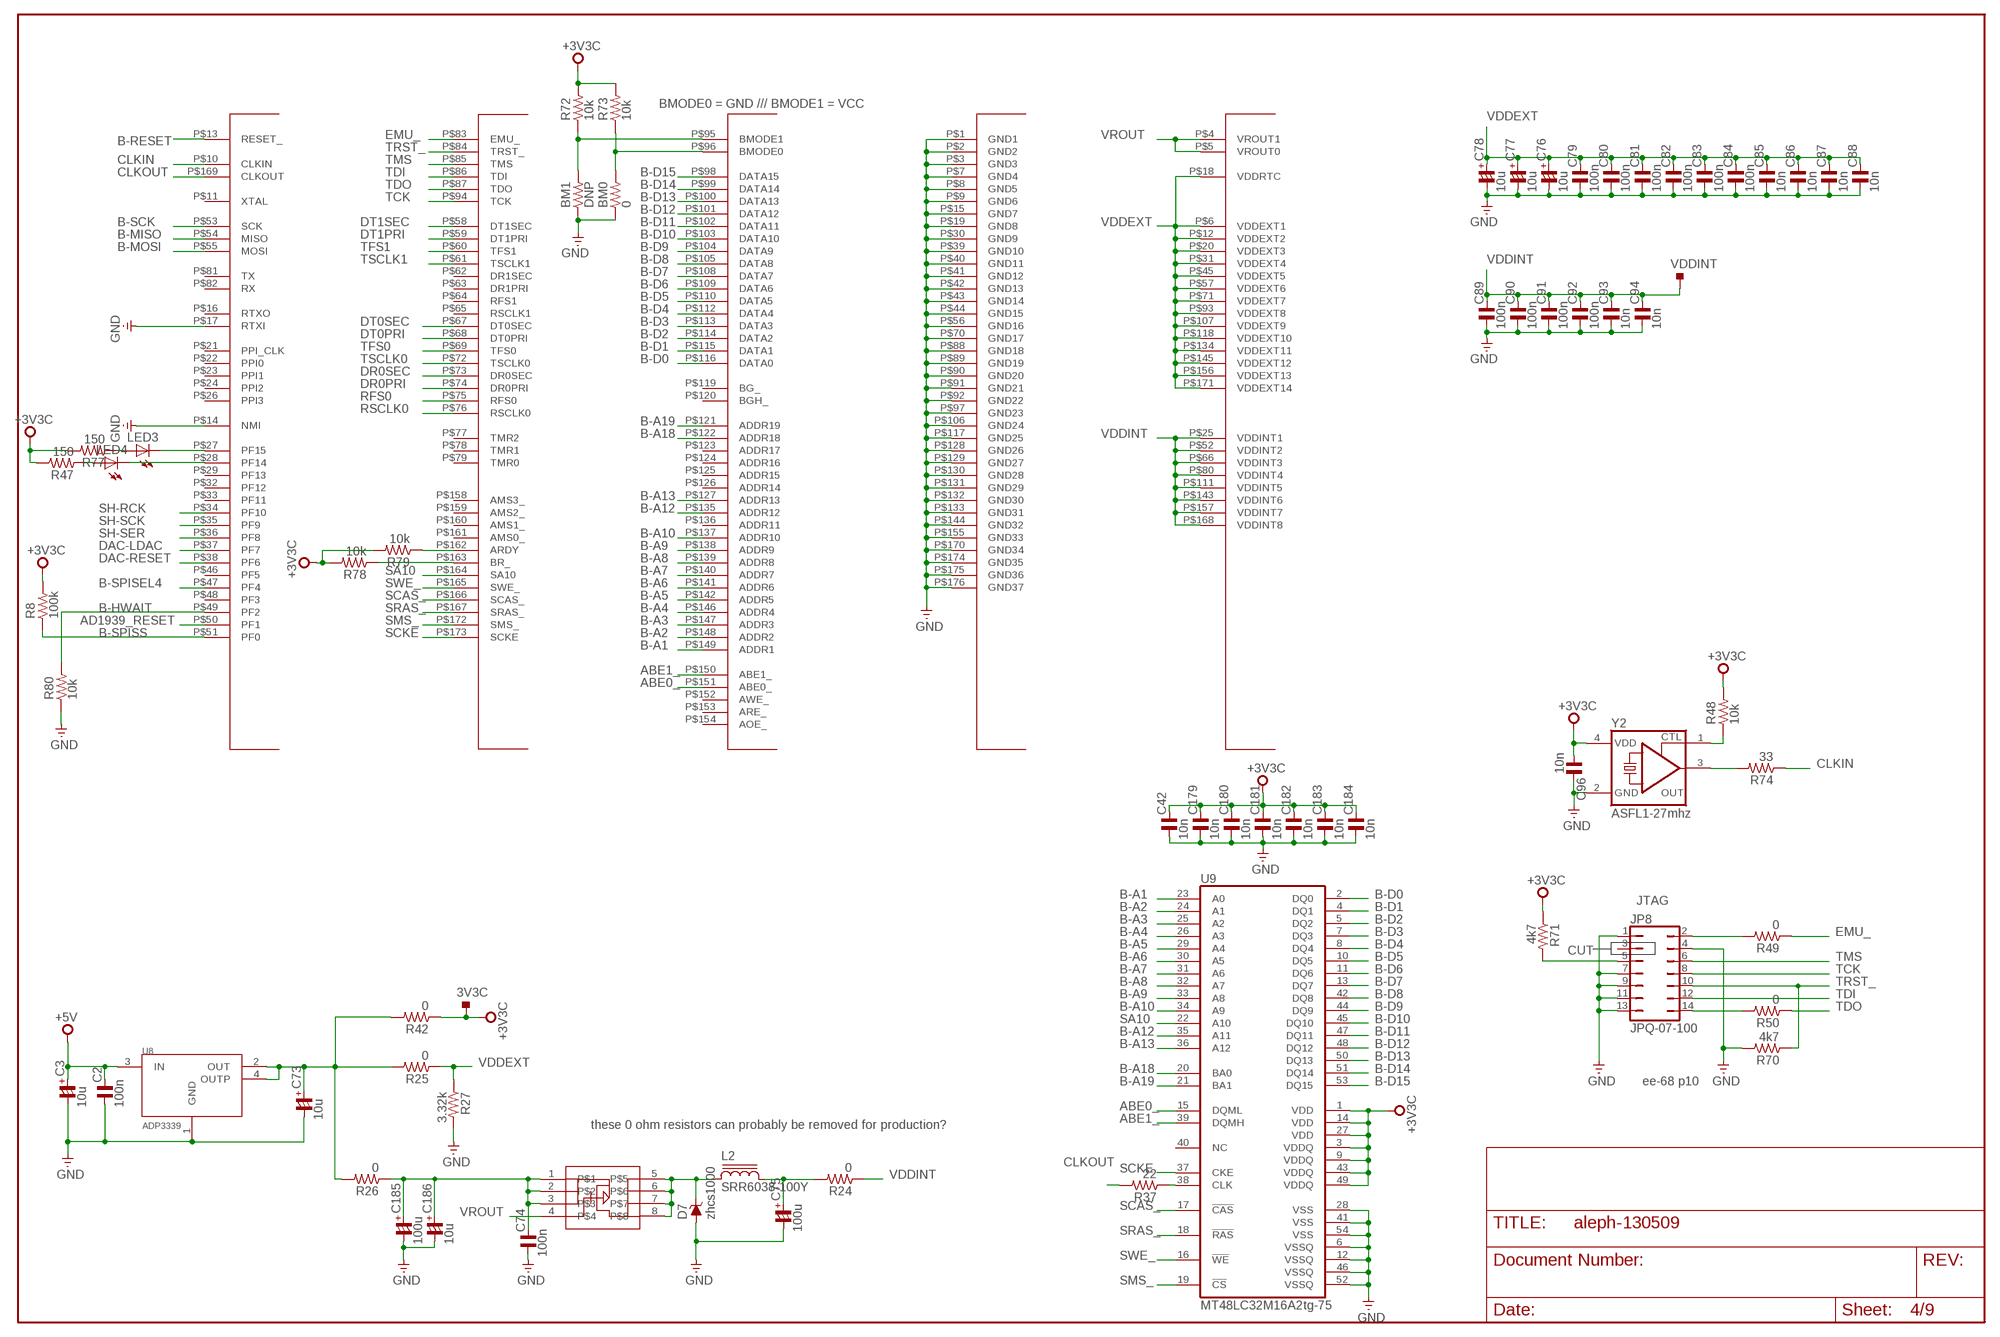
[diagram p4: schematic, sheet 4]

### Parts
3V3C  TPS-SMD-15R  [SMD-15R]
BM0  0  R_0603  [R0603]
BM1  DNP  R_0603  [R0603]
C2  100n  C_1206  [C1206]
C3  10u  CP_1206/T  [C1206/T]
C42  10n  C_0603  [C0603]
C73  10u  CP_1206/T  [C1206/T]
C74  100n  C_1206  [C1206]
C75  100u  CP_1210/T  [C1210/T]
C76  10u  CP_1206/T  [C1206/T]
C77  10u  CP_1206/T  [C1206/T]
C78  10u  CP_1206/T  [C1206/T]
C79  100n  C_0603  [C0603]
C80  100n  C_0603  [C0603]
C81  100n  C_0603  [C0603]
C82  100n  C_0603  [C0603]
C83  100n  C_0603  [C0603]
C84  100n  C_0603  [C0603]
C85  10n  C_0603  [C0603]
C86  10n  C_0603  [C0603]
C87  10n  C_0603  [C0603]
C88  10n  C_0603  [C0603]
C89  100n  C_0603  [C0603]
C90  100n  C_0603  [C0603]
C91  100n  C_0603  [C0603]
C92  100n  C_0603  [C0603]
C93  10n  C_0603  [C0603]
C94  10n  C_0603  [C0603]
C96  10n  C_0603  [C0603]
C179  10n  C_0603  [C0603]
C180  10n  C_0603  [C0603]
C181  10n  C_0603  [C0603]
C182  10n  C_0603  [C0603]
C183  10n  C_0603  [C0603]
C184  10n  C_0603  [C0603]
C185  100u  CP_1210/T  [C1210/T]
C186  10u  CP_1206/T  [C1206/T]
D7  zhcs1000  ZENER-DIODESOT23  [SOT23]
DSP1  BF533  [LQFP176]
JP8  JPQ-07-100  [JPQ-07]
L2  SRR6038-100Y  SRR6038  [SRR6038]
LED3  LEDCHIPLED_0805  [CHIPLED_0805]
LED4  LEDCHIPLED_0805  [CHIPLED_0805]
R8  100k  R_0603  [R0603]
R24  0  R_0603  [R0603]
R25  0  R_0603  [R0603]
R26  0  R_0603  [R0603]
R27  3.32k  R_0603  [R0603]
R37  22  R_0603  [R0603]
R42  0  R_0603  [R0603]
R47  150  R_0603  [R0603]
R48  10k  R_0603  [R0603]
R49  0  R_0603  [R0603]
R50  0  R_0603  [R0603]
R70  4k7  R_0603  [R0603]
R71  4k7  R_0603  [R0603]
R72  10k  R_0603  [R0603]
R73  10k  R_0603  [R0603]
R74  33  R_0603  [R0603]
R77  150  R_0603  [R0603]
R78  10k  R_0603  [R0603]
R79  10k  R_0603  [R0603]
R80  10k  R_0603  [R0603]
U8  ADP3339  [SOT223]
U9  MT48LC32M16A2tg-75  MT48LC16M16A2  [TSOP54]
U18  FDS9431A  [SO08]
VDDINT  TPS-SMD-10R  [SMD-10R]
Y2  ASFL1-27mhz  ASFL1  [ASFL1]

### Nets
+3V3C: 3V3C.TP C42.2 C96.1 C179.2 C180.2 C181.2 C182.2 C183.2 C184.2 R8.2 R42.1 R47.2 R48.2 R71.1 R72.2 R73.2 R77.2 R78.2 R79.2 U9.1(VDD) U9.3(VDDQ) U9.9(VDDQ) U9.14(VDD) U9.27(VDD) U9.43(VDDQ) U9.49(VDDQ) Y2.4(VDD) ; also sheet 5,6
+5V: C2.2 C3.+ U8.3(IN) ; also sheet 2,3,6
ABE0_: DSP1.P$151(ABE0_) U9.15(DQML)
ABE1_: DSP1.P$150(ABE1_) U9.39(DQMH)
AD1939_RESET: DSP1.P$50(PF1) ; also sheet 5
B-A1: DSP1.P$149(ADDR1) U9.23(A0)
B-A2: DSP1.P$148(ADDR2) U9.24(A1)
B-A3: DSP1.P$147(ADDR3) U9.25(A2)
B-A4: DSP1.P$146(ADDR4) U9.26(A3)
B-A5: DSP1.P$142(ADDR5) U9.29(A4)
B-A6: DSP1.P$141(ADDR6) U9.30(A5)
B-A7: DSP1.P$140(ADDR7) U9.31(A6)
B-A8: DSP1.P$139(ADDR8) U9.32(A7)
B-A9: DSP1.P$138(ADDR9) U9.33(A8)
B-A10: DSP1.P$137(ADDR10) U9.34(A9)
B-A12: DSP1.P$135(ADDR12) U9.35(A11)
B-A13: DSP1.P$127(ADDR13) U9.36(A12)
B-A18: DSP1.P$122(ADDR18) U9.20(BA0)
B-A19: DSP1.P$121(ADDR19) U9.21(BA1)
B-D0: DSP1.P$116(DATA0) U9.2(DQ0)
B-D1: DSP1.P$115(DATA1) U9.4(DQ1)
B-D2: DSP1.P$114(DATA2) U9.5(DQ2)
B-D3: DSP1.P$113(DATA3) U9.7(DQ3)
B-D4: DSP1.P$112(DATA4) U9.8(DQ4)
B-D5: DSP1.P$110(DATA5) U9.10(DQ5)
B-D6: DSP1.P$109(DATA6) U9.11(DQ6)
B-D7: DSP1.P$108(DATA7) U9.13(DQ7)
B-D8: DSP1.P$105(DATA8) U9.42(DQ8)
B-D9: DSP1.P$104(DATA9) U9.44(DQ9)
B-D10: DSP1.P$103(DATA10) U9.45(DQ10)
B-D11: DSP1.P$102(DATA11) U9.47(DQ11)
B-D12: DSP1.P$101(DATA12) U9.48(DQ12)
B-D13: DSP1.P$100(DATA13) U9.50(DQ13)
B-D14: DSP1.P$99(DATA14) U9.51(DQ14)
B-D15: DSP1.P$98(DATA15) U9.53(DQ15)
B-HWAIT: DSP1.P$49(PF2) R80.2 ; also sheet 1
B-MISO: DSP1.P$54(MISO) ; also sheet 1
B-MOSI: DSP1.P$55(MOSI) ; also sheet 1
B-RESET: DSP1.P$13(RESET_) ; also sheet 1
B-SCK: DSP1.P$53(SCK) ; also sheet 1
B-SPISEL4: DSP1.P$47(PF4)
B-SPISS: DSP1.P$51(PF0) R8.1 ; also sheet 1
BMODE0: BM0.2 DSP1.P$96(BMODE0) R73.1
BMODE1: BM1.2 DSP1.P$95(BMODE1) R72.1
CLKIN: DSP1.P$10(CLKIN) R74.1
CLKOUT: DSP1.P$169(CLKOUT) R37.2
DAC-LDAC: DSP1.P$37(PF7) ; also sheet 6
DAC-RESET: DSP1.P$38(PF6) ; also sheet 6
DR0PRI: DSP1.P$74(DR0PRI) ; also sheet 5
DR0SEC: DSP1.P$73(DR0SEC) ; also sheet 5
DT0PRI: DSP1.P$68(DT0PRI) ; also sheet 5
DT0SEC: DSP1.P$67(DT0SEC) ; also sheet 5
DT1PRI: DSP1.P$59(DT1PRI)
DT1SEC: DSP1.P$58(DT1SEC) ; also sheet 6
EMU_: DSP1.P$83(EMU_) R49.1
GND: BM0.1 BM1.1 C2.1 C3.- C42.1 C73.- C74.1 C75.- C76.- C77.- C78.- C79.1 C80.1 C81.1 C82.1 C83.1 C84.1 C85.1 C86.1 C87.1 C88.1 C89.1 C90.1 C91.1 C92.1 C93.1 C94.1 C96.2 C179.1 C180.1 C181.1 C182.1 C183.1 C184.1 C185.- C186.- D7.1(A) DSP1.P$1(GND1) DSP1.P$2(GND2) DSP1.P$3(GND3) DSP1.P$7(GND4) DSP1.P$8(GND5) DSP1.P$9(GND6) DSP1.P$14(NMI) DSP1.P$15(GND7) DSP1.P$17(RTXI) DSP1.P$19(GND8) DSP1.P$30(GND9) DSP1.P$39(GND10) DSP1.P$40(GND11) DSP1.P$41(GND12) DSP1.P$42(GND13) DSP1.P$43(GND14) DSP1.P$44(GND15) DSP1.P$56(GND16) DSP1.P$70(GND17) DSP1.P$88(GND18) DSP1.P$89(GND19) DSP1.P$90(GND20) DSP1.P$91(GND21) DSP1.P$92(GND22) DSP1.P$97(GND23) DSP1.P$106(GND24) DSP1.P$117(GND25) DSP1.P$128(GND26) DSP1.P$129(GND27) DSP1.P$130(GND28) DSP1.P$131(GND29) DSP1.P$132(GND30) DSP1.P$133(GND31) DSP1.P$144(GND32) DSP1.P$155(GND33) DSP1.P$170(GND34) DSP1.P$174(GND35) DSP1.P$175(GND36) DSP1.P$176(GND37) JP8.1 JP8.4 JP8.7 JP8.9 JP8.11 JP8.13 R27.2 R70.2 R80.1 U8.1(GND) U9.6(VSSQ) U9.12(VSSQ) U9.28(VSS) U9.41(VSS) U9.46(VSSQ) U9.52(VSSQ) U9.54(VSS) Y2.2(GND) ; also sheet 1,2,3,5
N$16: C73.+ R25.2 R26.2 R42.2 U8.2(OUT) U8.4(OUTP)
N$18: C74.2 C185.+ C186.+ R26.1 U18.1 U18.2 U18.3
N$19: D7.3(C) L2.1 U18.5 U18.6 U18.7 U18.8
N$22: C75.+ L2.2 R24.2
N$24: R37.1 U9.38(CLK)
N$25: R48.1 Y2.1(CTL)
N$26: JP8.2 R49.2
N$28: JP8.5 R71.2
N$29: DSP1.P$163(BR_) R78.1
N$31: JP8.14 R50.2
N$35: DSP1.P$162(ARDY) R79.1
N$38: R74.2 Y2.3(OUT)
N$60: DSP1.P$27(PF15) LED3.C
N$64: DSP1.P$28(PF14) LED4.C
N$66: LED3.A R77.1
N$67: LED4.A R47.1
RFS0: DSP1.P$75(RFS0) ; also sheet 5
RSCLK0: DSP1.P$76(RSCLK0) ; also sheet 5
SA10: DSP1.P$164(SA10) U9.22(A10)
SCAS_: DSP1.P$166(SCAS_) U9.17(!CAS!)
SCKE: DSP1.P$173(SCKE) U9.37(CKE)
SH-RCK: DSP1.P$34(PF10)
SH-SCK: DSP1.P$35(PF9)
SH-SER: DSP1.P$36(PF8)
SMS_: DSP1.P$172(SMS_) U9.19(!CS!)
SRAS_: DSP1.P$167(SRAS_) U9.18(!RAS!)
SWE_: DSP1.P$165(SWE_) U9.16(!WE!)
TCK: DSP1.P$94(TCK) JP8.8
TDI: DSP1.P$86(TDI) JP8.12
TDO: DSP1.P$87(TDO) R50.1
TFS0: DSP1.P$69(TFS0) ; also sheet 5
TFS1: DSP1.P$60(TFS1) ; also sheet 6
TMS: DSP1.P$85(TMS) JP8.6
TRST_: DSP1.P$84(TRST_) JP8.10 R70.1
TSCLK0: DSP1.P$72(TSCLK0) ; also sheet 5
TSCLK1: DSP1.P$61(TSCLK1) ; also sheet 6
VDDEXT: C76.+ C77.+ C78.+ C79.2 C80.2 C81.2 C82.2 C83.2 C84.2 C85.2 C86.2 C87.2 C88.2 DSP1.P$6(VDDEXT1) DSP1.P$12(VDDEXT2) DSP1.P$18(VDDRTC) DSP1.P$20(VDDEXT3) DSP1.P$31(VDDEXT4) DSP1.P$45(VDDEXT5) DSP1.P$57(VDDEXT6) DSP1.P$71(VDDEXT7) DSP1.P$93(VDDEXT8) DSP1.P$107(VDDEXT9) DSP1.P$118(VDDEXT10) DSP1.P$134(VDDEXT11) DSP1.P$145(VDDEXT12) DSP1.P$156(VDDEXT13) DSP1.P$171(VDDEXT14) R25.1 R27.1
VDDINT: C89.2 C90.2 C91.2 C92.2 C93.2 C94.2 DSP1.P$25(VDDINT1) DSP1.P$52(VDDINT2) DSP1.P$66(VDDINT3) DSP1.P$80(VDDINT4) DSP1.P$111(VDDINT5) DSP1.P$143(VDDINT6) DSP1.P$157(VDDINT7) DSP1.P$168(VDDINT8) R24.1 VDDINT.TP
VROUT: DSP1.P$4(VROUT1) DSP1.P$5(VROUT0) U18.4
Unconnected: DSP1.P$11(XTAL) DSP1.P$16(RTXO) DSP1.P$21(PPI_CLK) DSP1.P$22(PPI0) DSP1.P$23(PPI1) DSP1.P$24(PPI2) DSP1.P$26(PPI3) DSP1.P$29(PF13) DSP1.P$32(PF12) DSP1.P$33(PF11) DSP1.P$46(PF5) DSP1.P$48(PF3) DSP1.P$62(DR1SEC) DSP1.P$63(DR1PRI) DSP1.P$64(RFS1) DSP1.P$65(RSCLK1) DSP1.P$77(TMR2) DSP1.P$78(TMR1) DSP1.P$79(TMR0) DSP1.P$81(TX) DSP1.P$82(RX) DSP1.P$119(BG_) DSP1.P$120(BGH_) DSP1.P$123(ADDR17) DSP1.P$124(ADDR16) DSP1.P$125(ADDR15) DSP1.P$126(ADDR14) DSP1.P$136(ADDR11) DSP1.P$152(AWE_) DSP1.P$153(ARE_) DSP1.P$154(AOE_) DSP1.P$158(AMS3_) DSP1.P$159(AMS2_) DSP1.P$160(AMS1_) DSP1.P$161(AMS0_) JP8.3 U9.40(NC)

### Notes on the sheet
- BMODE0 = GND /// BMODE1 = VCC
- JTAG
- CUT
- ee-68 p10
- these 0 ohm resistors can probably be removed for production?

## Sheet 5 of 9
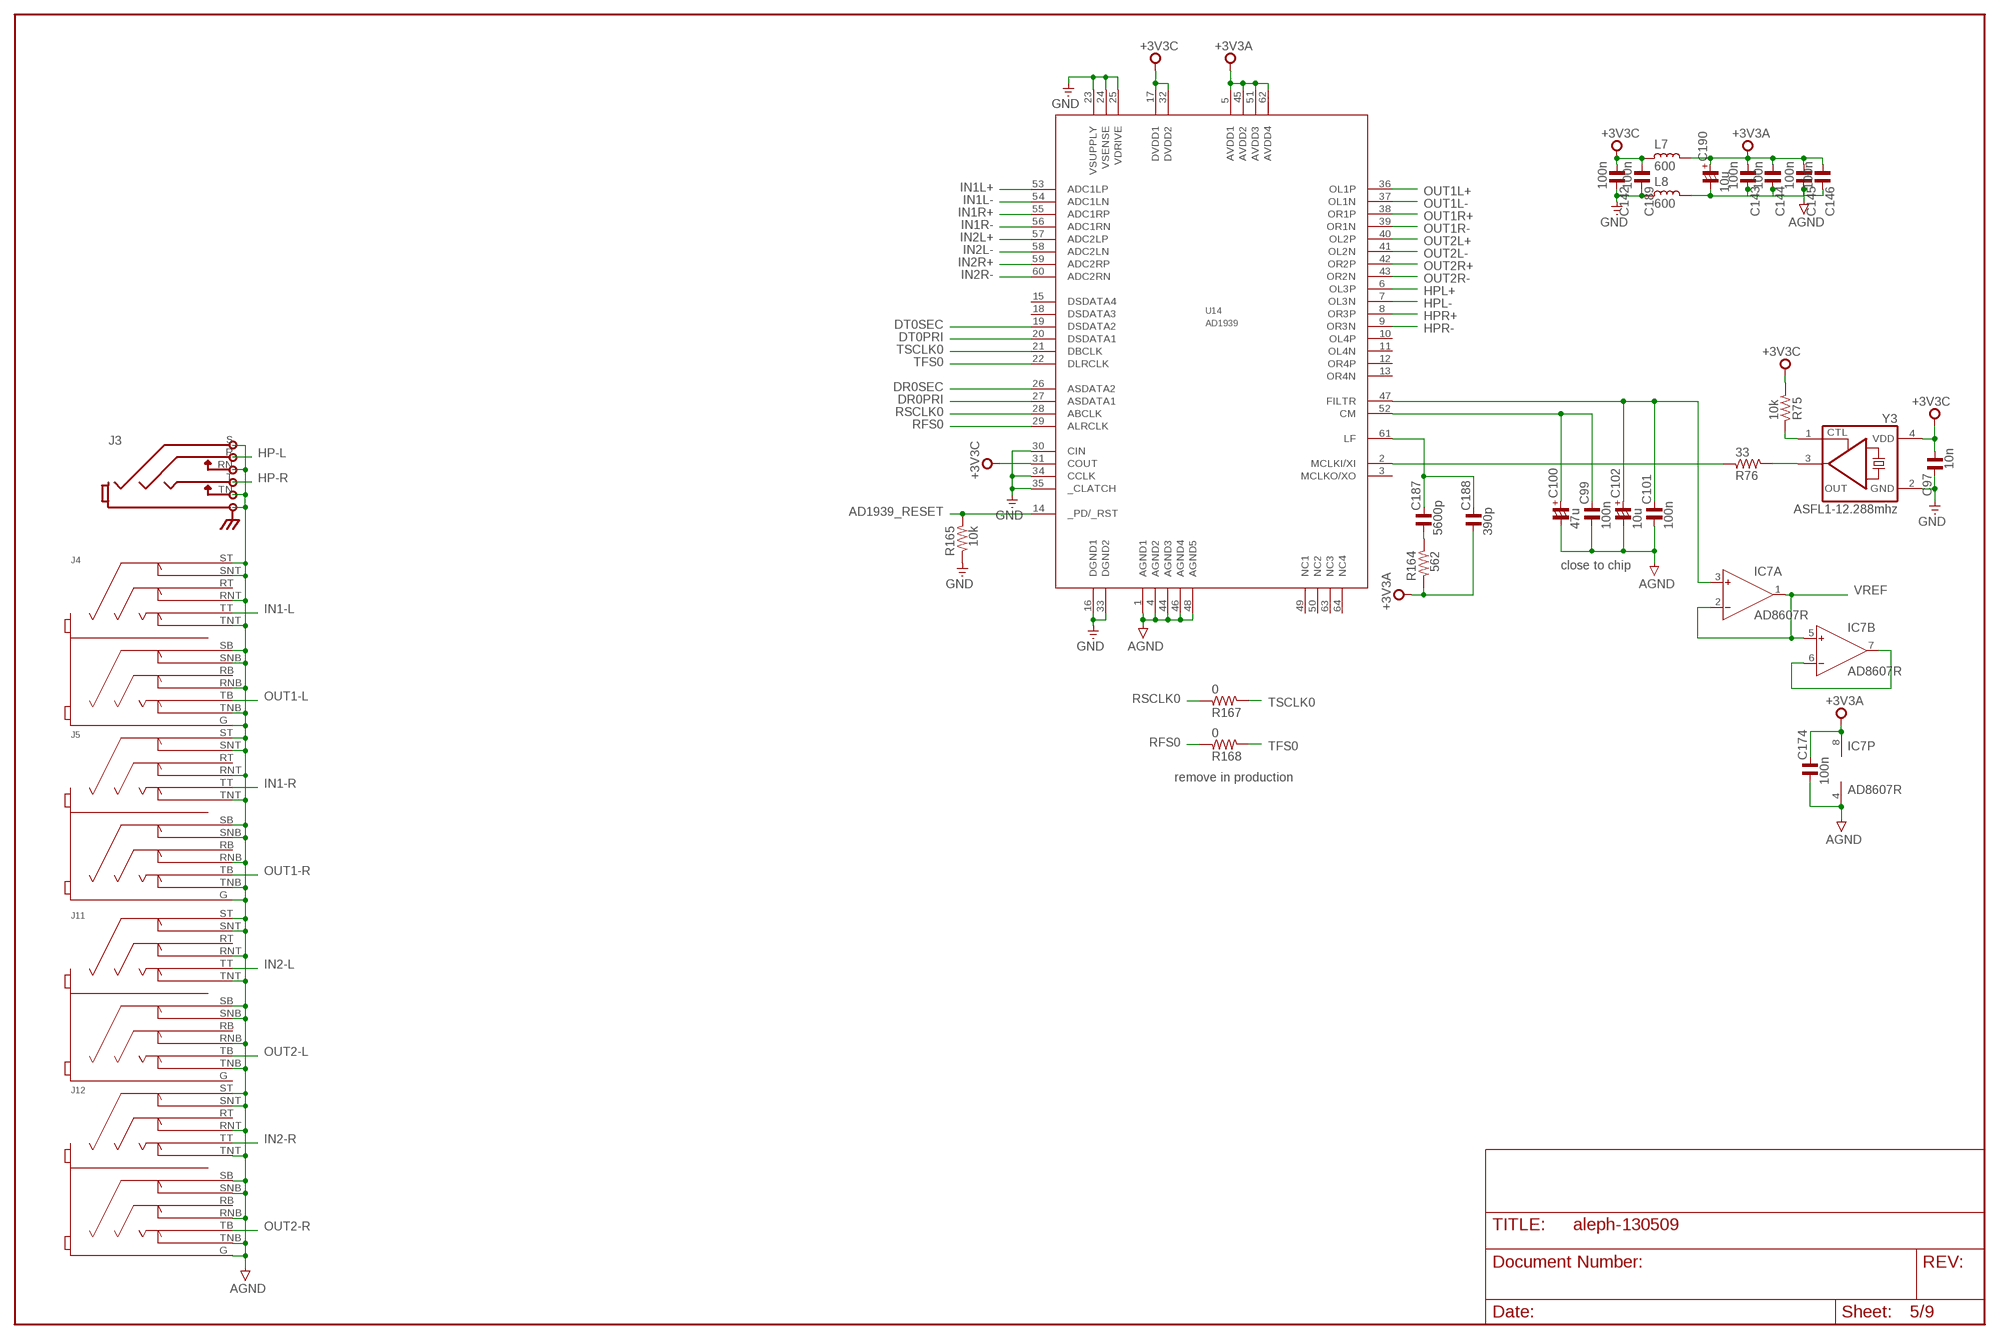
[diagram p5: schematic, sheet 5]

### Parts
C97  10n  C_0603  [C0603]
C99  100n  C_0603  [C0603]
C100  47u  CP_1206/T  [C1206/T]
C101  100n  C_0603  [C0603]
C102  10u  CP_1206/T  [C1206/T]
C142  100n  C_0603  [C0603]
C143  100n  C_0603  [C0603]
C144  100n  C_0603  [C0603]
C145  100n  C_0603  [C0603]
C146  100n  C_0603  [C0603]
C174  100n  C_0603  [C0603]
C187  5600p  C_0603  [C0603]
C188  390p  C_0603  [C0603]
C189  100n  C_0603  [C0603]
C190  10u  CP_1206/T  [C1206/T]
IC7  AD8607R  [SO8]
J3  STEREOSW2GND  [NEUTRIK-NRJ6HM-1]
J4  NSJ12HF  [NSJ12HF]
J5  NSJ12HF  [NSJ12HF]
J11  NSJ12HF  [NSJ12HF]
J12  NSJ12HF  [NSJ12HF]
L7  600  L_1206  [L1206]
L8  600  L_1206  [L1206]
R75  10k  R_0603  [R0603]
R76  33  R_0603  [R0603]
R164  562  R_0603  [R0603]
R165  10k  R_0603  [R0603]
R167  0  R_0603  [R0603]
R168  0  R_0603  [R0603]
U14  AD1939  [SQFP-S-10X10-64]
Y3  ASFL1-12.288mhz  ASFL1  [ASFL1]

### Nets
+3V3A: C143.1 C144.1 C145.1 C146.1 C174.2 C188.1 C190.+ IC7.8(P:V+) L7.1 R164.2 U14.5(AVDD1) U14.45(AVDD2) U14.51(AVDD3) U14.62(AVDD4) ; also sheet 7,8
+3V3C: C97.1 C142.1 C189.1 L7.2 R75.2 U14.17(DVDD1) U14.31(COUT) U14.32(DVDD2) Y3.4(VDD) ; also sheet 4,6
AD1939_RESET: R165.1 U14.14(_PD/_RST) ; also sheet 4
AGND: C99.1 C100.- C101.1 C102.- C143.2 C144.2 C145.2 C146.2 C174.1 C190.- IC7.4(P:V-) J3.RN J3.S J3.TN J4.G J4.RNB J4.RNT J4.SB J4.SNB J4.SNT J4.ST J4.TNB J4.TNT J5.G J5.RNB J5.RNT J5.SB J5.SNB J5.SNT J5.ST J5.TNB J5.TNT J11.RNB J11.RNT J11.SB J11.SNB J11.SNT J11.ST J11.TNB J11.TNT J12.G J12.RNB J12.RNT J12.SB J12.SNB J12.SNT J12.ST J12.TNB J12.TNT L8.1 U14.1(AGND1) U14.4(AGND2) U14.44(AGND3) U14.46(AGND4) U14.48(AGND5) ; also sheet 3,6,7,8,9
DR0PRI: U14.27(ASDATA1) ; also sheet 4
DR0SEC: U14.26(ASDATA2) ; also sheet 4
DT0PRI: U14.20(DSDATA1) ; also sheet 4
DT0SEC: U14.19(DSDATA2) ; also sheet 4
GND: C97.2 C142.2 C189.2 L8.2 R165.2 U14.16(DGND1) U14.23(VSUPPLY) U14.24(VSENSE) U14.25(VDRIVE) U14.30(CIN) U14.33(DGND2) U14.34(CCLK) U14.35(_CLATCH) Y3.2(GND) ; also sheet 1,2,3,4
HP-L: J3.R ; also sheet 6
HP-R: J3.T ; also sheet 6
HPL+: U14.6(OL3P)
HPL-: U14.7(OL3N)
HPR+: U14.8(OR3P)
HPR-: U14.9(OR3N)
IN1-L: J4.TT ; also sheet 6
IN1-R: J5.TT ; also sheet 6
IN1L+: U14.53(ADC1LP) ; also sheet 8
IN1L-: U14.54(ADC1LN) ; also sheet 8
IN1R+: U14.55(ADC1RP) ; also sheet 8
IN1R-: U14.56(ADC1RN) ; also sheet 8
IN2-L: J11.TT ; also sheet 8
IN2-R: J12.TT ; also sheet 8
IN2L+: U14.57(ADC2LP) ; also sheet 8
IN2L-: U14.58(ADC2LN) ; also sheet 8
IN2R+: U14.59(ADC2RP) ; also sheet 8
IN2R-: U14.60(ADC2RN) ; also sheet 8
N$36: R75.1 Y3.1(CTL)
N$57: R76.2 Y3.3(OUT)
N$59: R76.1 U14.2(MCLKI/XI)
N$61: C101.2 C102.+ IC7.3(A:IN+) U14.47(FILTR)
N$62: C99.2 C100.+ U14.52(CM)
N$63: C187.2 C188.2 U14.61(LF)
N$65: C187.1 R164.1
N$131: IC7.6(B:IN-) IC7.7(B:OUT)
OUT1-L: J4.TB ; also sheet 6
OUT1-R: J5.TB ; also sheet 6
OUT1L+: U14.36(OL1P) ; also sheet 7
OUT1L-: U14.37(OL1N) ; also sheet 7
OUT1R+: U14.38(OR1P) ; also sheet 7
OUT1R-: U14.39(OR1N) ; also sheet 7
OUT2-L: J11.TB ; also sheet 7
OUT2-R: J12.TB ; also sheet 7
OUT2L+: U14.40(OL2P) ; also sheet 7
OUT2L-: U14.41(OL2N) ; also sheet 7
OUT2R+: U14.42(OR2P) ; also sheet 7
OUT2R-: U14.43(OR2N) ; also sheet 7
RFS0: R168.1 U14.29(ALRCLK) ; also sheet 4
RSCLK0: R167.1 U14.28(ABCLK) ; also sheet 4
TFS0: R168.2 U14.22(DLRCLK) ; also sheet 4
TSCLK0: R167.2 U14.21(DBCLK) ; also sheet 4
VREF: IC7.1(A:OUT) IC7.2(A:IN-) IC7.5(B:IN+) ; also sheet 7,8
Unconnected: J4.RB J4.RT J5.RB J5.RT J11.G J11.RB J11.RT J12.RB J12.RT U14.3(MCLKO/XO) U14.10(OL4P) U14.11(OL4N) U14.12(OR4P) U14.13(OR4N) U14.15(DSDATA4) U14.18(DSDATA3) U14.49(NC1) U14.50(NC2) U14.63(NC3) U14.64(NC4)

### Notes on the sheet
- close to chip
- remove in production

## Sheet 6 of 9
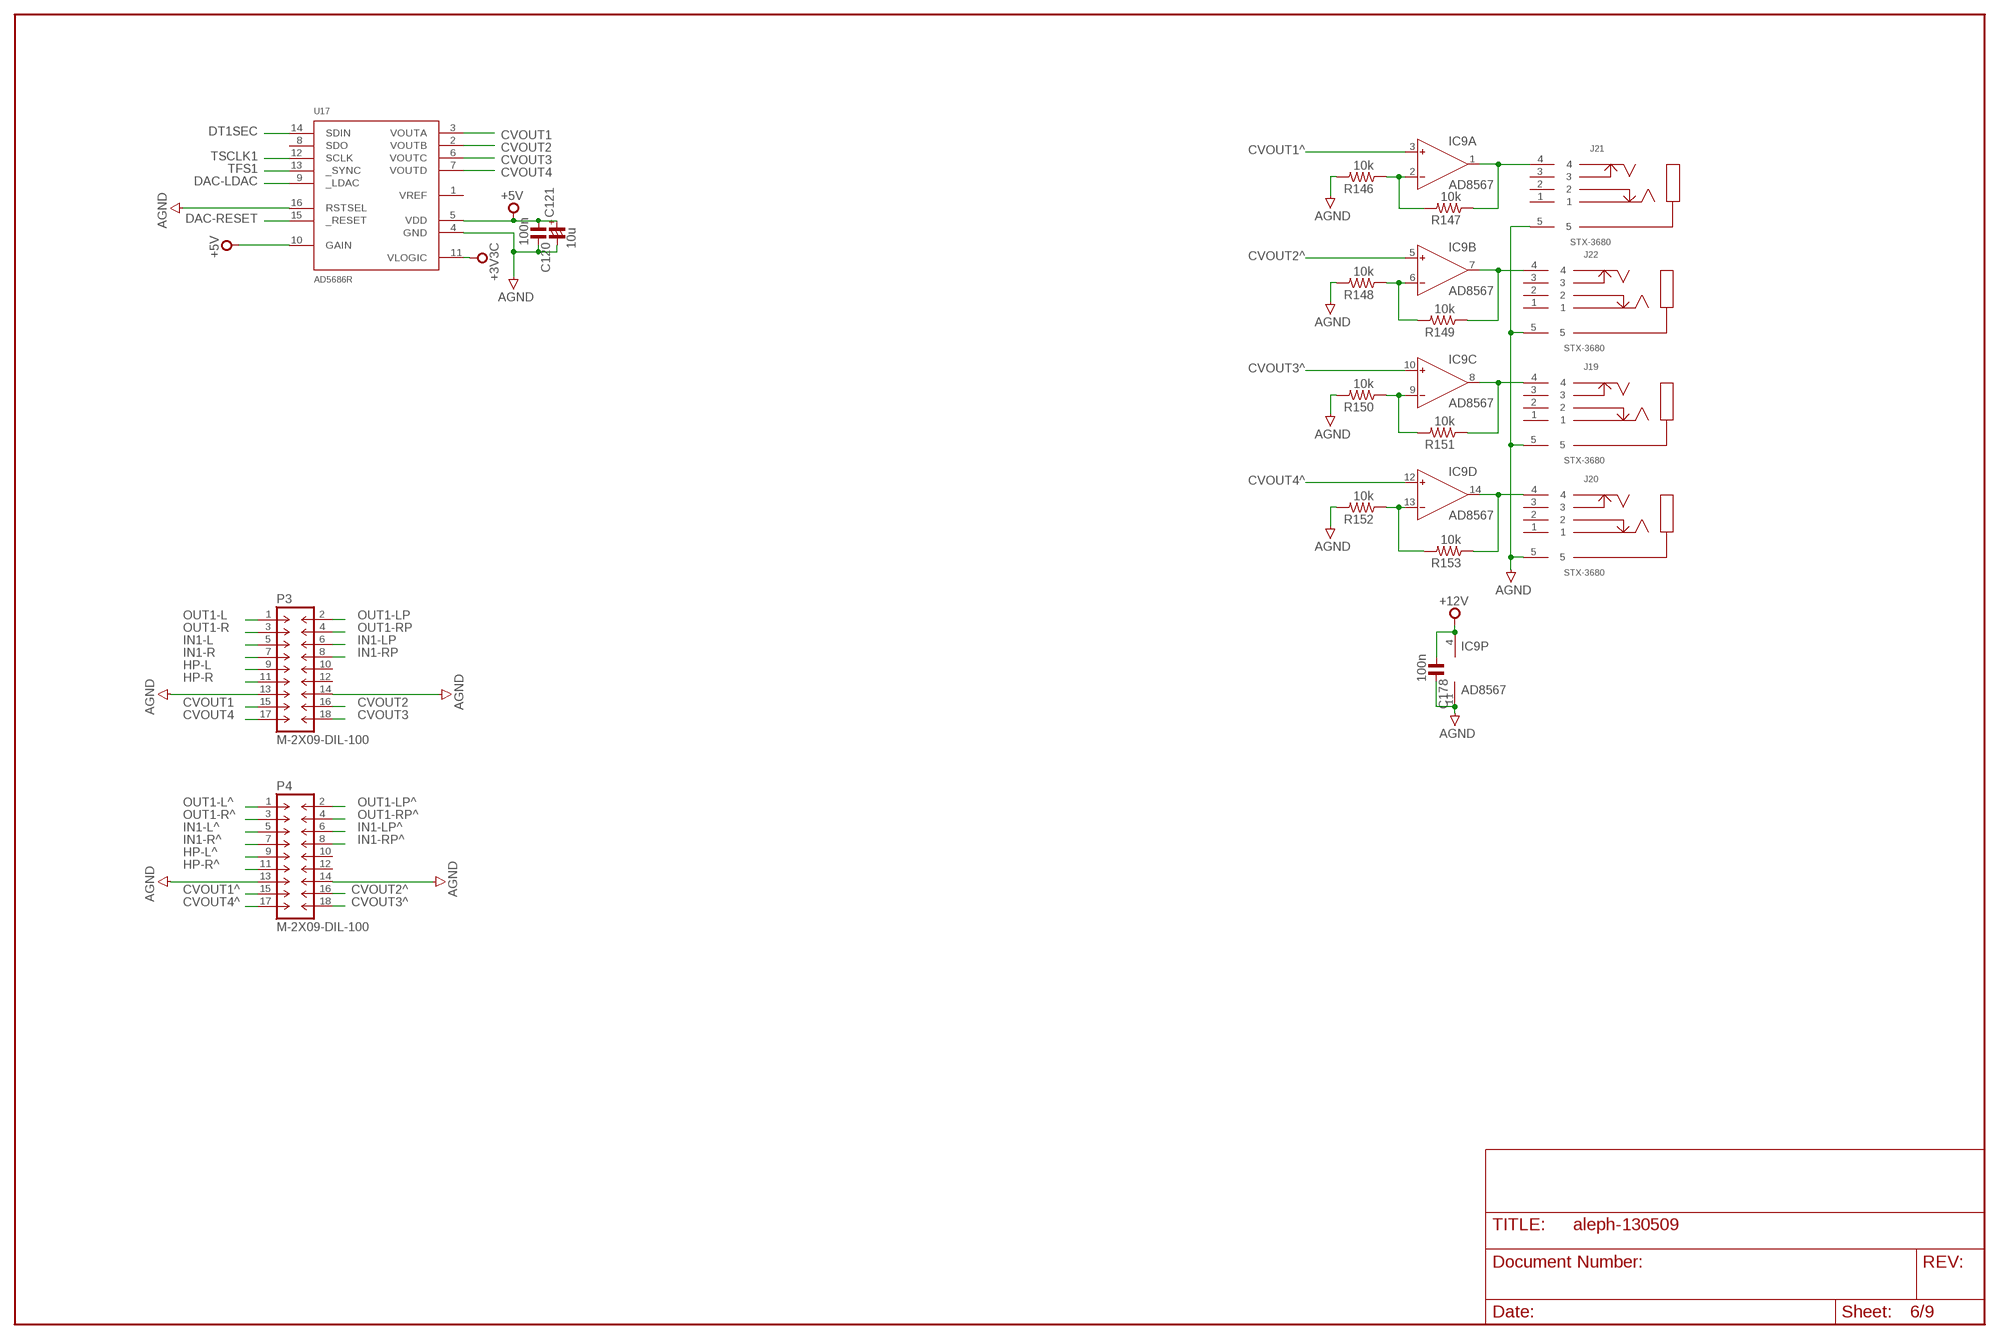
[diagram p6: schematic, sheet 6]

### Parts
C120  100n  C_0603  [C0603]
C121  10u  CP_1206/T  [C1206/T]
C178  100n  C_0603  [C0603]
IC9  AD8567  AD8544RU  [TSSOP14]
J19  STX-3680  [STX-3680]
J20  STX-3680  [STX-3680]
J21  STX-3680  [STX-3680]
J22  STX-3680  [STX-3680]
P3  M-2X09-DIL-100  [DIL-100-2X09]
P4  M-2X09-DIL-100  [DIL-100-2X09]
R146  10k  R_0603  [R0603]
R147  10k  R_0603  [R0603]
R148  10k  R_0603  [R0603]
R149  10k  R_0603  [R0603]
R150  10k  R_0603  [R0603]
R151  10k  R_0603  [R0603]
R152  10k  R_0603  [R0603]
R153  10k  R_0603  [R0603]
U17  AD5686R  [TSSOP16]

### Nets
+3V3C: U17.11(VLOGIC) ; also sheet 4,5
+5V: C120.1 C121.+ U17.5(VDD) U17.10(GAIN) ; also sheet 2,3,4
+12V: C178.1 IC9.4(P:V+) ; also sheet 2,3
AGND: C120.2 C121.- C178.2 IC9.11(P:V-) J19.5 J20.5 J21.5 J22.5 P3.13 P3.14 P4.13 P4.14 R146.2 R148.2 R150.2 R152.2 U17.4(GND) U17.16(RSTSEL) ; also sheet 3,5,7,8,9
CVOUT1: P3.15 U17.3(VOUTA)
CVOUT1^: IC9.3(A:IN+) P4.15
CVOUT2: P3.16 U17.2(VOUTB)
CVOUT2^: IC9.5(B:IN+) P4.16
CVOUT3: P3.18 U17.6(VOUTC)
CVOUT3^: IC9.10(C:IN+) P4.18
CVOUT4: P3.17 U17.7(VOUTD)
CVOUT4^: IC9.12(D:IN+) P4.17
DAC-LDAC: U17.9(_LDAC) ; also sheet 4
DAC-RESET: U17.15(_RESET) ; also sheet 4
DT1SEC: U17.14(SDIN) ; also sheet 4
HP-L: P3.9 ; also sheet 5
HP-L^: P4.9 ; also sheet 7
HP-R: P3.11 ; also sheet 5
HP-R^: P4.11 ; also sheet 7
IN1-L: P3.5 ; also sheet 5
IN1-L^: P4.5 ; also sheet 9
IN1-LP: P3.6 ; also sheet 8
IN1-LP^: P4.6 ; also sheet 9
IN1-R: P3.7 ; also sheet 5
IN1-R^: P4.7 ; also sheet 9
IN1-RP: P3.8 ; also sheet 8
IN1-RP^: P4.8 ; also sheet 9
N$1: IC9.2(A:IN-) R146.1 R147.2
N$56: IC9.1(A:OUT) J21.4 R147.1
N$132: IC9.6(B:IN-) R148.1 R149.2
N$135: IC9.9(C:IN-) R150.1 R151.2
N$136: IC9.13(D:IN-) R152.1 R153.2
N$137: IC9.8(C:OUT) J19.4 R151.1
N$138: IC9.14(D:OUT) J20.4 R153.1
N$139: IC9.7(B:OUT) J22.4 R149.1
OUT1-L: P3.1 ; also sheet 5
OUT1-L^: P4.1 ; also sheet 7
OUT1-LP: P3.2 ; also sheet 7
OUT1-LP^: P4.2 ; also sheet 7
OUT1-R: P3.3 ; also sheet 5
OUT1-R^: P4.3 ; also sheet 7
OUT1-RP: P3.4 ; also sheet 7
OUT1-RP^: P4.4 ; also sheet 7
TFS1: U17.13(_SYNC) ; also sheet 4
TSCLK1: U17.12(SCLK) ; also sheet 4
Unconnected: J19.1 J19.2 J19.3 J20.1 J20.2 J20.3 J21.1 J21.2 J21.3 J22.1 J22.2 J22.3 P3.10 P3.12 P4.10 P4.12 U17.1(VREF) U17.8(SDO)

## Sheet 7 of 9
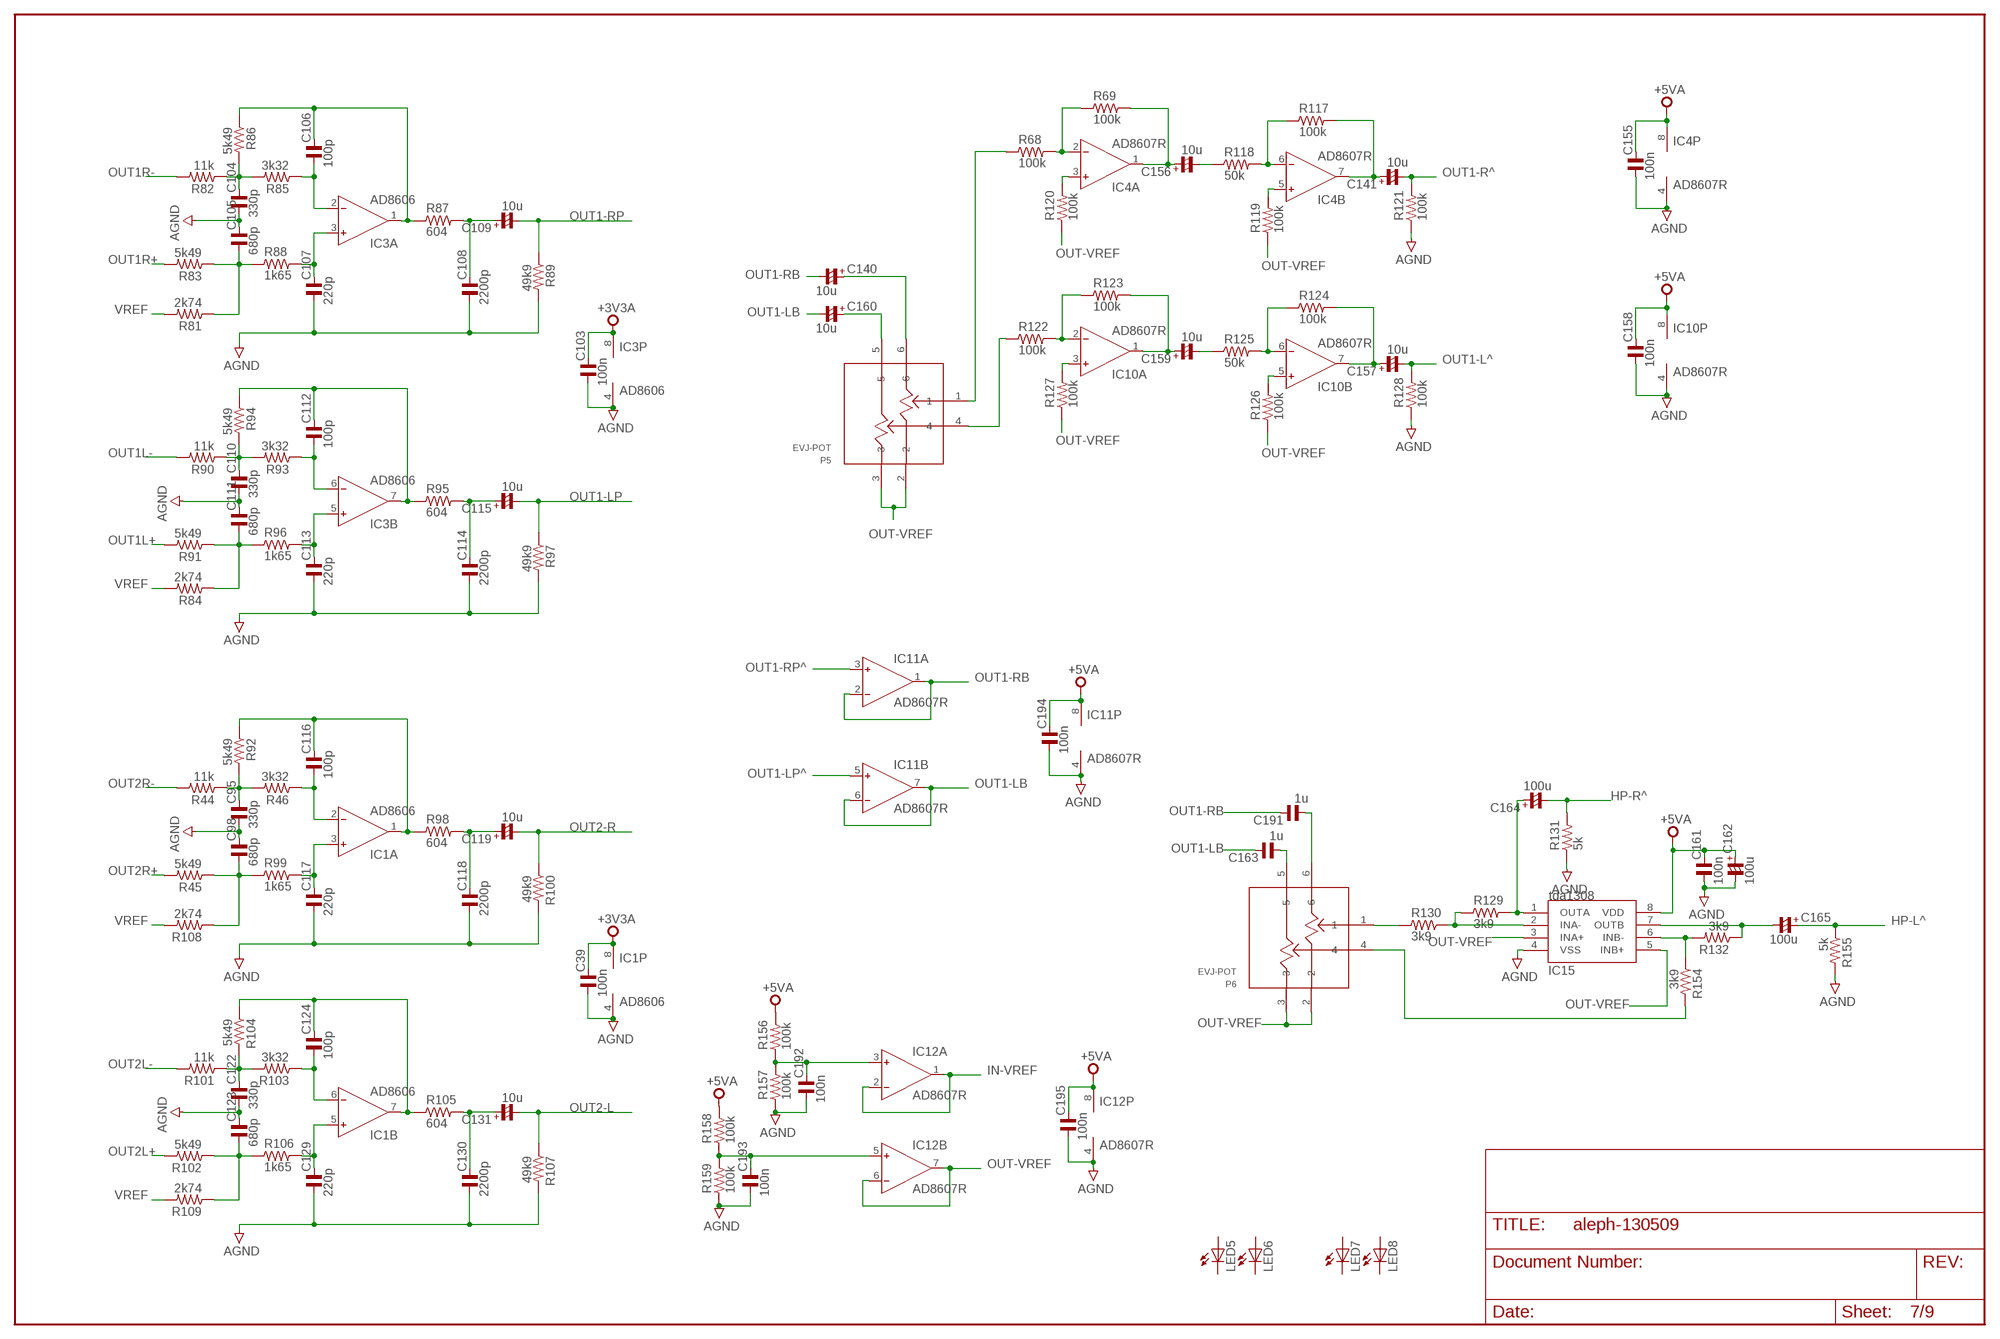
[diagram p7: schematic, sheet 7]

### Parts
C39  100n  C_0603  [C0603]
C95  330p  C_0603  [C0603]
C98  680p  C_0603  [C0603]
C103  100n  C_0603  [C0603]
C104  330p  C_0603  [C0603]
C105  680p  C_0603  [C0603]
C106  100p  C_0603  [C0603]
C107  220p  C_0603  [C0603]
C108  2200p  C_0603  [C0603]
C109  10u  CP_1206/T  [C1206/T]
C110  330p  C_0603  [C0603]
C111  680p  C_0603  [C0603]
C112  100p  C_0603  [C0603]
C113  220p  C_0603  [C0603]
C114  2200p  C_0603  [C0603]
C115  10u  CP_1206/T  [C1206/T]
C116  100p  C_0603  [C0603]
C117  220p  C_0603  [C0603]
C118  2200p  C_0603  [C0603]
C119  10u  CP_1206/T  [C1206/T]
C122  330p  C_0603  [C0603]
C123  680p  C_0603  [C0603]
C124  100p  C_0603  [C0603]
C129  220p  C_0603  [C0603]
C130  2200p  C_0603  [C0603]
C131  10u  CP_1206/T  [C1206/T]
C140  10u  CP_1206/T  [C1206/T]
C141  10u  CP_1206/T  [C1206/T]
C155  100n  C_0603  [C0603]
C156  10u  CP_1206/T  [C1206/T]
C157  10u  CP_1206/T  [C1206/T]
C158  100n  C_0603  [C0603]
C159  10u  CP_1206/T  [C1206/T]
C160  10u  CP_1206/T  [C1206/T]
C161  100n  C_0603  [C0603]
C162  100u  CP_1206/T  [C1206/T]
C163  1u  C_0603  [C0603]
C164  100u  CP_1206/T  [C1206/T]
C165  100u  CP_1206/T  [C1206/T]
C191  1u  C_0603  [C0603]
C192  100n  C_0603  [C0603]
C193  100n  C_0603  [C0603]
C194  100n  C_0603  [C0603]
C195  100n  C_0603  [C0603]
IC1  AD8606  AD8607R  [SO8]
IC3  AD8606  AD8607R  [SO8]
IC4  AD8607R  [SO8]
IC10  AD8607R  [SO8]
IC11  AD8607R  [SO8]
IC12  AD8607R  [SO8]
IC15  tda1308  TDA1308  [SO08]
LED5  LEDCHIPLED_0805  [CHIPLED_0805]
LED6  LEDCHIPLED_0805  [CHIPLED_0805]
LED7  LEDCHIPLED_0805  [CHIPLED_0805]
LED8  LEDCHIPLED_0805  [CHIPLED_0805]
P5  EVJ-POT  [EVJ-POT]
P6  EVJ-POT  [EVJ-POT]
R44  11k  R_0603  [R0603]
R45  5k49  R_0603  [R0603]
R46  3k32  R_0603  [R0603]
R68  100k  R_0603  [R0603]
R69  100k  R_0603  [R0603]
R81  2k74  R_0603  [R0603]
R82  11k  R_0603  [R0603]
R83  5k49  R_0603  [R0603]
R84  2k74  R_0603  [R0603]
R85  3k32  R_0603  [R0603]
R86  5k49  R_0603  [R0603]
R87  604  R_0603  [R0603]
R88  1k65  R_0603  [R0603]
R89  49k9  R_0603  [R0603]
R90  11k  R_0603  [R0603]
R91  5k49  R_0603  [R0603]
R92  5k49  R_0603  [R0603]
R93  3k32  R_0603  [R0603]
R94  5k49  R_0603  [R0603]
R95  604  R_0603  [R0603]
R96  1k65  R_0603  [R0603]
R97  49k9  R_0603  [R0603]
R98  604  R_0603  [R0603]
R99  1k65  R_0603  [R0603]
R100  49k9  R_0603  [R0603]
R101  11k  R_0603  [R0603]
R102  5k49  R_0603  [R0603]
R103  3k32  R_0603  [R0603]
R104  5k49  R_0603  [R0603]
R105  604  R_0603  [R0603]
R106  1k65  R_0603  [R0603]
R107  49k9  R_0603  [R0603]
R108  2k74  R_0603  [R0603]
R109  2k74  R_0603  [R0603]
R117  100k  R_0603  [R0603]
R118  50k  R_0603  [R0603]
R119  100k  R_0603  [R0603]
R120  100k  R_0603  [R0603]
R121  100k  R_0603  [R0603]
R122  100k  R_0603  [R0603]
R123  100k  R_0603  [R0603]
R124  100k  R_0603  [R0603]
R125  50k  R_0603  [R0603]
R126  100k  R_0603  [R0603]
R127  100k  R_0603  [R0603]
R128  100k  R_0603  [R0603]
R129  3k9  R_0603  [R0603]
R130  3k9  R_0603  [R0603]
R131  5k  R_0603  [R0603]
R132  3k9  R_0603  [R0603]
R154  3k9  R_0603  [R0603]
R155  5k  R_0603  [R0603]
R156  100k  R_0603  [R0603]
R157  100k  R_0603  [R0603]
R158  100k  R_0603  [R0603]
R159  100k  R_0603  [R0603]

### Nets
+3V3A: C39.2 C103.2 IC1.8(P:V+) IC3.8(P:V+) ; also sheet 5,8
+5VA: C155.2 C158.2 C161.2 C162.+ C194.2 C195.2 IC4.8(P:V+) IC10.8(P:V+) IC11.8(P:V+) IC12.8(P:V+) IC15.8(VDD) R156.2 R158.2 ; also sheet 2,3,9
AGND: C39.1 C95.1 C98.2 C103.1 C104.1 C105.2 C107.1 C108.1 C110.1 C111.2 C113.1 C114.1 C117.1 C118.1 C122.1 C123.2 C129.1 C130.1 C155.1 C158.1 C161.1 C162.- C192.1 C193.1 C194.1 C195.1 IC1.4(P:V-) IC3.4(P:V-) IC4.4(P:V-) IC10.4(P:V-) IC11.4(P:V-) IC12.4(P:V-) IC15.4(VSS) R89.2 R97.2 R100.2 R107.2 R121.1 R128.1 R131.1 R155.2 R157.1 R159.1 ; also sheet 3,5,6,8,9
HP-L^: C165.+ R155.1 ; also sheet 6
HP-R^: C164.- R131.2 ; also sheet 6
IN-VREF: IC12.1(A:OUT) IC12.2(A:IN-) ; also sheet 9
N$68: C104.2 R82.1 R85.2 R86.2
N$69: C105.1 R81.1 R83.1 R88.1
N$70: C107.2 IC3.3(A:IN+) R88.2
N$71: C106.2 IC3.1(A:OUT) R86.1 R87.1
N$72: C108.2 C109.+ R87.2
N$73: C110.2 R90.1 R93.2 R94.2
N$74: C106.1 IC3.2(A:IN-) R85.1
N$75: C111.1 R84.1 R91.1 R96.1
N$76: C113.2 IC3.5(B:IN+) R96.2
N$77: C112.2 IC3.7(B:OUT) R94.1 R95.1
N$78: C114.2 C115.+ R95.2
N$79: C112.1 IC3.6(B:IN-) R93.1
N$80: C95.2 R44.1 R46.2 R92.2
N$81: C98.1 R45.1 R99.1 R108.1
N$82: C117.2 IC1.3(A:IN+) R99.2
N$83: C116.2 IC1.1(A:OUT) R92.1 R98.1
N$84: C118.2 C119.+ R98.2
N$85: C116.1 IC1.2(A:IN-) R46.1
N$86: C122.2 R101.1 R103.2 R104.2
N$87: C123.1 R102.1 R106.1 R109.1
N$88: C129.2 IC1.5(B:IN+) R106.2
N$89: IC4.3(A:IN+) R120.2
N$90: IC4.2(A:IN-) R68.2 R69.1
N$91: C140.+ P5.6
N$92: C124.2 IC1.7(B:OUT) R104.1 R105.1
N$93: C156.+ IC4.1(A:OUT) R69.2
N$94: C130.2 C131.+ R105.2
N$95: C124.1 IC1.6(B:IN-) R103.1
N$102: C156.- R118.1
N$103: IC4.6(B:IN-) R117.1 R118.2
N$107: C141.+ IC4.7(B:OUT) R117.2
N$109: IC10.3(A:IN+) R127.2
N$111: IC4.5(B:IN+) R119.2
N$112: P5.1 R68.1
N$113: IC10.2(A:IN-) R122.2 R123.1
N$114: C159.+ IC10.1(A:OUT) R123.2
N$115: C159.- R125.1
N$120: IC10.6(B:IN-) R124.1 R125.2
N$121: C157.+ IC10.7(B:OUT) R124.2
N$122: IC10.5(B:IN+) R126.2
N$130: P5.4 R122.1
N$140: C160.+ P5.5
N$141: IC15.2(INA-) R129.1 R130.2
N$148: C164.+ IC15.1(OUTA) R129.2
N$149: C163.1 P6.5
N$150: IC15.6(INB-) R132.2 R154.1
N$151: C191.1 P6.6
N$152: C192.2 IC12.3(A:IN+) R156.1 R157.2
N$154: C165.- IC15.7(OUTB) R132.1
N$156: P6.4 R154.2
N$157: P6.1 R130.1
N$163: C193.2 IC12.5(B:IN+) R158.1 R159.2
OUT1-L^: C157.- R128.2 ; also sheet 6
OUT1-LB: C160.- C163.2 IC11.6(B:IN-) IC11.7(B:OUT)
OUT1-LP: C115.- R97.1 ; also sheet 6
OUT1-LP^: IC11.5(B:IN+) ; also sheet 6
OUT1-R^: C141.- R121.2 ; also sheet 6
OUT1-RB: C140.- C191.2 IC11.1(A:OUT) IC11.2(A:IN-)
OUT1-RP: C109.- R89.1 ; also sheet 6
OUT1-RP^: IC11.3(A:IN+) ; also sheet 6
OUT1L+: R91.2 ; also sheet 5
OUT1L-: R90.2 ; also sheet 5
OUT1R+: R83.2 ; also sheet 5
OUT1R-: R82.2 ; also sheet 5
OUT2-L: C131.- R107.1 ; also sheet 5
OUT2-R: C119.- R100.1 ; also sheet 5
OUT2L+: R102.2 ; also sheet 5
OUT2L-: R101.2 ; also sheet 5
OUT2R+: R45.2 ; also sheet 5
OUT2R-: R44.2 ; also sheet 5
OUT-VREF: IC12.6(B:IN-) IC12.7(B:OUT) IC15.3(INA+) IC15.5(INB+) P5.2 P5.3 P6.2 P6.3 R119.1 R120.1 R126.1 R127.1
VREF: R81.2 R84.2 R108.2 R109.2 ; also sheet 5,8
Unconnected: LED5.A LED5.C LED6.A LED6.C LED7.A LED7.C LED8.A LED8.C

## Sheet 8 of 9
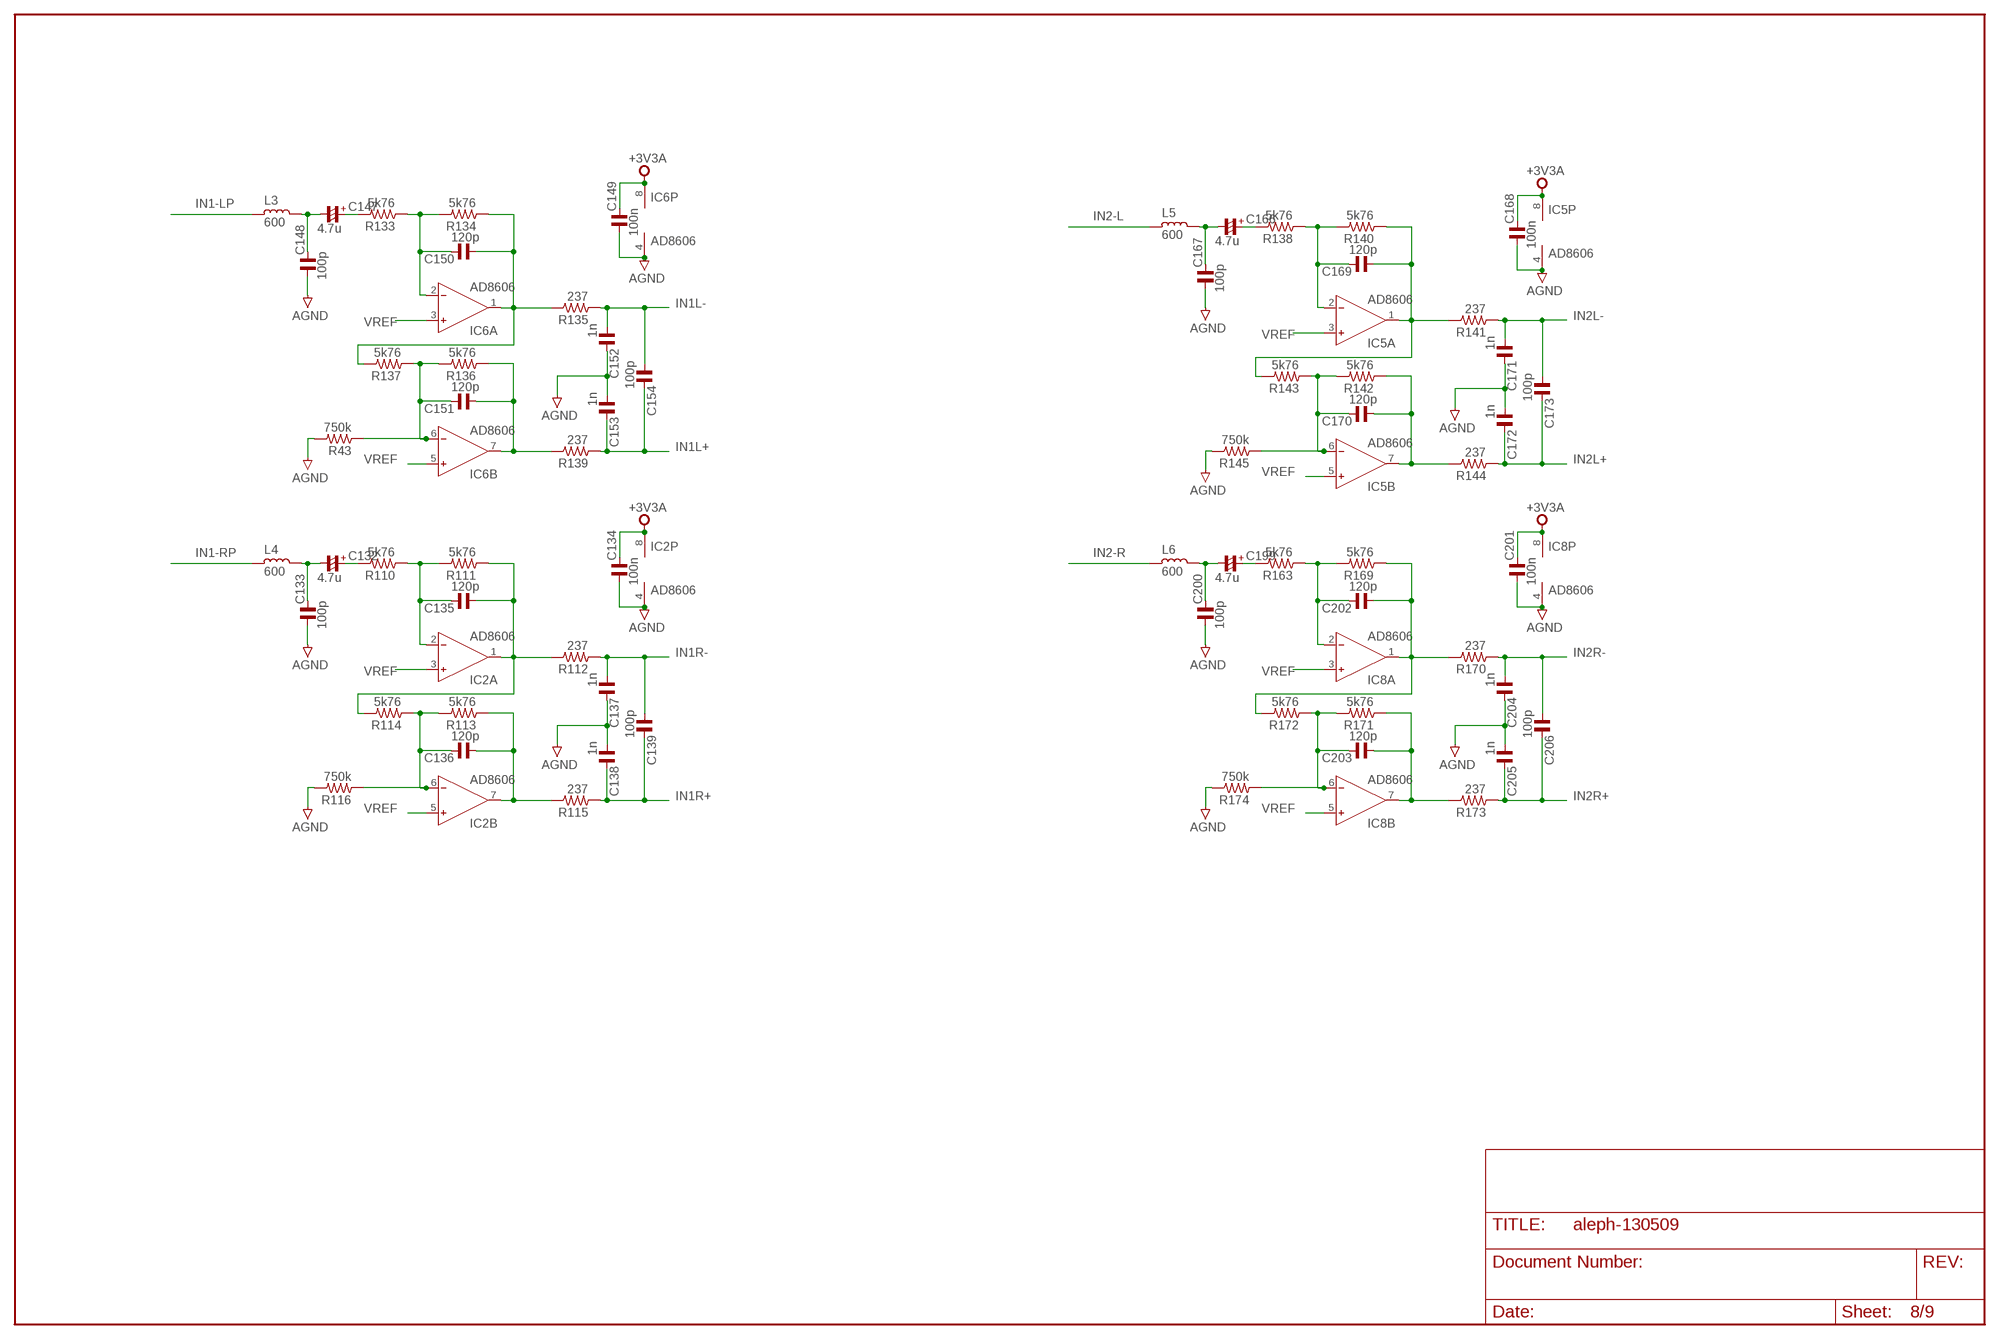
[diagram p8: schematic, sheet 8]

### Parts
C132  4.7u  CP_1206/T  [C1206/T]
C133  100p  C_0603  [C0603]
C134  100n  C_0603  [C0603]
C135  120p  C_0603  [C0603]
C136  120p  C_0603  [C0603]
C137  1n  C_0603  [C0603]
C138  1n  C_0603  [C0603]
C139  100p  C_0603  [C0603]
C147  4.7u  CP_1206/T  [C1206/T]
C148  100p  C_0603  [C0603]
C149  100n  C_0603  [C0603]
C150  120p  C_0603  [C0603]
C151  120p  C_0603  [C0603]
C152  1n  C_0603  [C0603]
C153  1n  C_0603  [C0603]
C154  100p  C_0603  [C0603]
C166  4.7u  CP_1206/T  [C1206/T]
C167  100p  C_0603  [C0603]
C168  100n  C_0603  [C0603]
C169  120p  C_0603  [C0603]
C170  120p  C_0603  [C0603]
C171  1n  C_0603  [C0603]
C172  1n  C_0603  [C0603]
C173  100p  C_0603  [C0603]
C199  4.7u  CP_1206/T  [C1206/T]
C200  100p  C_0603  [C0603]
C201  100n  C_0603  [C0603]
C202  120p  C_0603  [C0603]
C203  120p  C_0603  [C0603]
C204  1n  C_0603  [C0603]
C205  1n  C_0603  [C0603]
C206  100p  C_0603  [C0603]
IC2  AD8606  AD8607R  [SO8]
IC5  AD8606  AD8607R  [SO8]
IC6  AD8606  AD8607R  [SO8]
IC8  AD8606  AD8607R  [SO8]
L3  600  L_1206  [L1206]
L4  600  L_1206  [L1206]
L5  600  L_1206  [L1206]
L6  600  L_1206  [L1206]
R43  750k  R_0603  [R0603]
R110  5k76  R_0603  [R0603]
R111  5k76  R_0603  [R0603]
R112  237  R_0603  [R0603]
R113  5k76  R_0603  [R0603]
R114  5k76  R_0603  [R0603]
R115  237  R_0603  [R0603]
R116  750k  R_0603  [R0603]
R133  5k76  R_0603  [R0603]
R134  5k76  R_0603  [R0603]
R135  237  R_0603  [R0603]
R136  5k76  R_0603  [R0603]
R137  5k76  R_0603  [R0603]
R138  5k76  R_0603  [R0603]
R139  237  R_0603  [R0603]
R140  5k76  R_0603  [R0603]
R141  237  R_0603  [R0603]
R142  5k76  R_0603  [R0603]
R143  5k76  R_0603  [R0603]
R144  237  R_0603  [R0603]
R145  750k  R_0603  [R0603]
R163  5k76  R_0603  [R0603]
R169  5k76  R_0603  [R0603]
R170  237  R_0603  [R0603]
R171  5k76  R_0603  [R0603]
R172  5k76  R_0603  [R0603]
R173  237  R_0603  [R0603]
R174  750k  R_0603  [R0603]

### Nets
+3V3A: C134.2 C149.2 C168.2 C201.2 IC2.8(P:V+) IC5.8(P:V+) IC6.8(P:V+) IC8.8(P:V+) ; also sheet 5,7
AGND: C133.1 C134.1 C137.2 C138.1 C148.1 C149.1 C152.2 C153.1 C167.1 C168.1 C171.2 C172.1 C200.1 C201.1 C204.2 C205.1 IC2.4(P:V-) IC5.4(P:V-) IC6.4(P:V-) IC8.4(P:V-) R43.2 R116.2 R145.2 R174.2 ; also sheet 3,5,6,7,9
IN1-LP: L3.2 ; also sheet 6
IN1-RP: L4.2 ; also sheet 6
IN1L+: C153.2 C154.2 R139.1 ; also sheet 5
IN1L-: C152.1 C154.1 R135.1 ; also sheet 5
IN1R+: C138.2 C139.2 R115.1 ; also sheet 5
IN1R-: C137.1 C139.1 R112.1 ; also sheet 5
IN2-L: L5.2 ; also sheet 5
IN2-R: L6.2 ; also sheet 5
IN2L+: C172.2 C173.2 R144.1 ; also sheet 5
IN2L-: C171.1 C173.1 R141.1 ; also sheet 5
IN2R+: C205.2 C206.2 R173.1 ; also sheet 5
IN2R-: C204.1 C206.1 R170.1 ; also sheet 5
N$53: C147.+ R133.2
N$96: C135.1 IC2.1(A:OUT) R111.1 R112.2 R114.2
N$97: C136.1 IC2.7(B:OUT) R113.1 R115.2
N$98: C132.- C133.2 L4.1
N$99: C135.2 IC2.2(A:IN-) R110.1 R111.2
N$100: C136.2 IC2.6(B:IN-) R113.2 R114.1 R116.1
N$101: C132.+ R110.2
N$104: C150.1 IC6.1(A:OUT) R134.1 R135.2 R137.2
N$105: C151.1 IC6.7(B:OUT) R136.1 R139.2
N$106: C147.- C148.2 L3.1
N$108: C150.2 IC6.2(A:IN-) R133.1 R134.2
N$110: C151.2 IC6.6(B:IN-) R43.1 R136.2 R137.1
N$123: C169.1 IC5.1(A:OUT) R140.1 R141.2 R143.2
N$125: C170.1 IC5.7(B:OUT) R142.1 R144.2
N$126: C166.- C167.2 L5.1
N$127: C169.2 IC5.2(A:IN-) R138.1 R140.2
N$128: C170.2 IC5.6(B:IN-) R142.2 R143.1 R145.1
N$129: C166.+ R138.2
N$142: C202.1 IC8.1(A:OUT) R169.1 R170.2 R172.2
N$143: C203.1 IC8.7(B:OUT) R171.1 R173.2
N$144: C199.- C200.2 L6.1
N$145: C202.2 IC8.2(A:IN-) R163.1 R169.2
N$146: C203.2 IC8.6(B:IN-) R171.2 R172.1 R174.1
N$147: C199.+ R163.2
VREF: IC2.3(A:IN+) IC2.5(B:IN+) IC5.3(A:IN+) IC5.5(B:IN+) IC6.3(A:IN+) IC6.5(B:IN+) IC8.3(A:IN+) IC8.5(B:IN+) ; also sheet 5,7

## Sheet 9 of 9
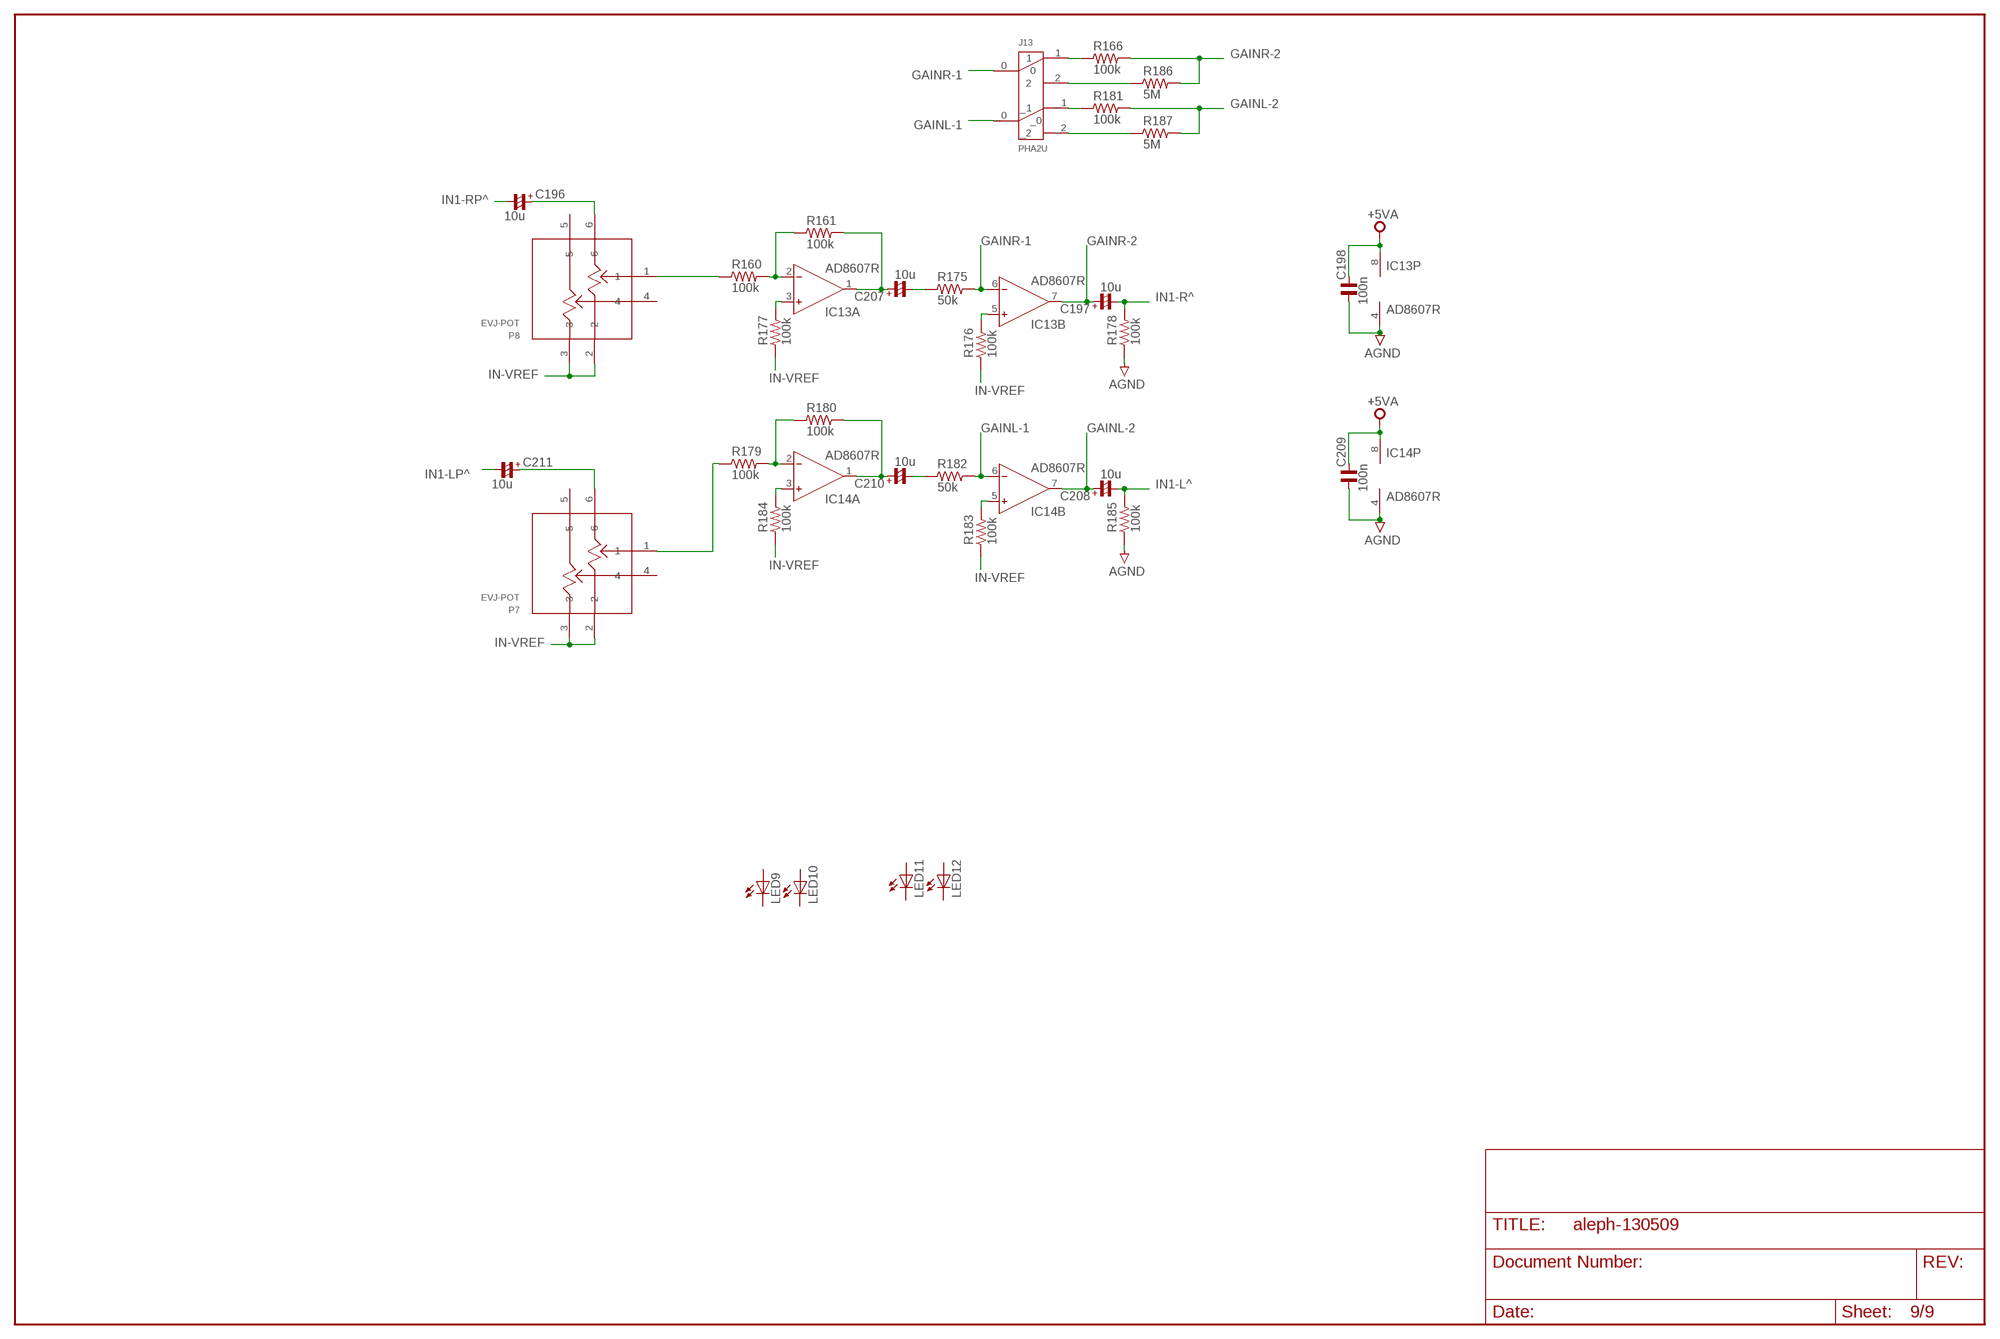
[diagram p9: schematic, sheet 9]

### Parts
C196  10u  CP_1206/T  [C1206/T]
C197  10u  CP_1206/T  [C1206/T]
C198  100n  C_0603  [C0603]
C207  10u  CP_1206/T  [C1206/T]
C208  10u  CP_1206/T  [C1206/T]
C209  100n  C_0603  [C0603]
C210  10u  CP_1206/T  [C1206/T]
C211  10u  CP_1206/T  [C1206/T]
IC13  AD8607R  [SO8]
IC14  AD8607R  [SO8]
J13  PHA2U  [PHA2U]
LED9  LEDCHIPLED_0805  [CHIPLED_0805]
LED10  LEDCHIPLED_0805  [CHIPLED_0805]
LED11  LEDCHIPLED_0805  [CHIPLED_0805]
LED12  LEDCHIPLED_0805  [CHIPLED_0805]
P7  EVJ-POT  [EVJ-POT]
P8  EVJ-POT  [EVJ-POT]
R160  100k  R_0603  [R0603]
R161  100k  R_0603  [R0603]
R166  100k  R_0603  [R0603]
R175  50k  R_0603  [R0603]
R176  100k  R_0603  [R0603]
R177  100k  R_0603  [R0603]
R178  100k  R_0603  [R0603]
R179  100k  R_0603  [R0603]
R180  100k  R_0603  [R0603]
R181  100k  R_0603  [R0603]
R182  50k  R_0603  [R0603]
R183  100k  R_0603  [R0603]
R184  100k  R_0603  [R0603]
R185  100k  R_0603  [R0603]
R186  5M  R_0603  [R0603]
R187  5M  R_0603  [R0603]

### Nets
+5VA: C198.2 C209.2 IC13.8(P:V+) IC14.8(P:V+) ; also sheet 2,3,7
AGND: C198.1 C209.1 IC13.4(P:V-) IC14.4(P:V-) R178.1 R185.1 ; also sheet 3,5,6,7,8
GAINL-1: IC14.6(B:IN-) J13._0 R182.2
GAINL-2: C208.+ IC14.7(B:OUT) R181.2 R187.2
GAINR-1: IC13.6(B:IN-) J13.0 R175.2
GAINR-2: C197.+ IC13.7(B:OUT) R166.2 R186.2
IN1-L^: C208.- R185.2 ; also sheet 6
IN1-LP^: C211.- ; also sheet 6
IN1-R^: C197.- R178.2 ; also sheet 6
IN1-RP^: C196.- ; also sheet 6
IN-VREF: P7.2 P7.3 P8.2 P8.3 R176.1 R177.1 R183.1 R184.1 ; also sheet 7
N$153: IC13.3(A:IN+) R177.2
N$155: IC13.2(A:IN-) R160.2 R161.1
N$158: C207.+ IC13.1(A:OUT) R161.2
N$159: C207.- R175.1
N$162: IC13.5(B:IN+) R176.2
N$164: C196.+ P8.6
N$165: P8.1 R160.1
N$166: IC14.3(A:IN+) R184.2
N$167: IC14.2(A:IN-) R179.2 R180.1
N$168: C210.+ IC14.1(A:OUT) R180.2
N$169: C210.- R182.1
N$172: IC14.5(B:IN+) R183.2
N$173: P7.1 R179.1
N$174: C211.+ P7.6
N$177: J13.1 R166.1
N$180: J13.2 R186.1
N$181: J13._1 R181.1
N$183: J13._2 R187.1
Unconnected: LED9.A LED9.C LED10.A LED10.C LED11.A LED11.C LED12.A LED12.C P7.4 P7.5 P8.4 P8.5

## Library data of the parts
3V3 3V3C 5V GND VDDINT VDDOUT = testpoint:TPS: TEST POINT PAD
BM0 BM1 R1-R187 = rc-master-smd:R_: RESISTOR
C1 C2 C4-C42 C44 C45 C47 C50 C52 C53 C55-C68 C70 C72 C74 C79-C99 C101 C103-C108 C110-C114 C116-C118 C120 C122-C126 C129 C130 C133-C139 C142-C146 C148-C155 C158 C161 C163 C167-C174 C177-C184 C187-C189 C191-C195 C198 C200-C206 C209 = rc-master-smd:C_: NON-POLARIZED CAP
C3 C43 C46 C48 C49 C51 C54 C69 C71 C73 C75-C78 C100 C102 C109 C115 C119 C121 C127 C128 C131 C132 C140 C141 C147 C156 C157 C159 C160 C162 C164-C166 C175 C176 C185 C186 C190 C196 C197 C199 C207 C208 C210 C211 = rc-master-smd:CP_: POLARIZED CAP
D1 D2 = diode:MBRS360T3: Schottkey Power Rectifier - 3A, 60V
D3-D6 = diode:1N4148: DIODE high speed (Philips)
D7 = diode:ZENER-DIODE: Z-Diode
D8 = diode:MBRS130LT3: Schottkey Diode - 1A, 30V
DSP1 = monome-inc:BF533
GND0 = pinhead:PINHD-1X1: PIN HEADER
IC1-IC8 IC10-IC14 = analog-devices:AD8607: Precision Micropower, Low Noise CMOS, Rail-to-Rail Input/Output Operational Amplifiers Source: http://www.analog.com/static/imported-files/data_sheets/AD8603_8607_8609.pdf; MPN: AD8607ARMZ-R2; OC_FARNELL: 1651293; OC_NEWARK: 19M8927
IC9 = analog-devices:AD8544: General-Purpose CMOS Rail-to-Rail Amplifiers Source: http://www.analog.com/static/imported-files/data_sheets/AD8541_8542_8544.pdf; MPN: AD8544ARUZ; OC_FARNELL: unknown; OC_NEWARK: 15P1001
IC15 = monome-inc:TDA1308
J1 = monome-inc:SJ1-3533NG: RIGHT ANGLE STEREO JACK 3.5mm
J2 = con-cuistack:PJ-102AH/BH: DC Power Jack PJ-102AH (2.1 x 5.5 MM) PJ-102BH (2.5 x 5.5 MM)
J3 J6 J7 = Audio Jacks 0.25 inch:STEREOSW2GND: 1/4" stereo jack, switched (unswitched sleeve), with chassis ground connection
J4 J5 J11 J12 = monome-inc:NSJ12HF: double stack 1/4" TRS jack
J8 = monome-inc:USBA-VERT
J9 = monome-inc:USB_TYPE_B: BERG USB connector
J10 J13 = monome-inc:PHA2U
J15-J22 = monome-inc:STX-3680
JP1 = atmel-avr32:AVR-JTAG-10: AVR JTAG Debug/Programming Header
JP4 = pinhead:PINHD-1X20: PIN HEADER
JP8 = jumpers:JPQ-07-: Jumper Block
K0 K1-K3 KM = monome-inc:PVA1
L1 = inductor-coilcraft:MSS1278: SMT Power Inductor
L2 = inductor-bourns:SRR6038: POWER INDUCTOR
L3-L8 L10 = rc-master-smd:L_: INDUCTOR
L9 = inductor-coilcraft:LPS4018: POWER INDUCTOR
LED1-LED12 = led:LED: LED OSRAM: - CHIPLED LG R971, LG N971, LY N971, LG Q971, LY Q971, LO R971, LY R971 LH N974, LH R974 LS Q976, LO Q976, LY Q976 LO Q996 - Hyper CHIPLED LW Q18S LB Q993, LB Q99A, LB R99A - SideLED LS A670, LO A670, LY A670, LG A670, LP A670 LB A673, LV A673, LT A673, LW A673 LH A674 LY A675 LS A676, LA A676, LO A676, LY A676, LW A676 LS A679, LY A679, LG A679 - Hyper Micro SIDELED® LS Y876, LA Y876, LO Y876, LY Y876 LT Y87S - SmartLED LW L88C, LW L88S LB L89C, LB L89S, LG L890 LS L89K, LO L89K, LY L89K LS L896, LA L896, LO L896, LY L896 - TOPLED LS T670, LO T670, LY T670, LG T670, LP T670 LSG T670, LSP T670, LSY T670, LOP T670, LYG T670 LG T671, LOG T671, LSG T671 LB T673, LV T673, LT T673, LW T673 LH T674 LS T676, LA T676, LO T676, LY T676, LB T676, LH T676, LSB T676, LW T676 LB T67C, LV T67C, LT T67C, LS T67K, LO T67K, LY T67K, LW E67C LS E67B, LA E67B, LO E67B, LY E67B, LB E67C, LV E67C, LT E67C LW T67C LS T679, LY T679, LG T679 LS T770, LO T770, LY T770, LG T770, LP T770 LB T773, LV T773, LT T773, LW T773 LH T774 LS E675, LA E675, LY E675, LS T675 LS T776, LA T776, LO T776, LY T776, LB T776 LHGB T686 LT T68C, LB T68C - Hyper Mini TOPLED® LB M676 - Mini TOPLED Santana® LG M470 LS M47K, LO M47K, LY M47K Source: http://www.osram.convergy.de LUXEON: - LUMILED® LXK2-PW12-R00, LXK2-PW12-S00, LXK2-PW14-U00, LXK2-PW14-V00 LXK2-PM12-R00, LXK2-PM12-S00, LXK2-PM14-U00 LXK2-PE12-Q00, LXK2-PE12-R00, LXK2-PE12-S00, LXK2-PE14-T00, LXK2-PE14-U00 LXK2-PB12-K00, LXK2-PB12-L00, LXK2-PB12-M00, LXK2-PB14-N00, LXK2-PB14-P00, LXK2-PB14-Q00 LXK2-PR12-L00, LXK2-PR12-M00, LXK2-PR14-Q00, LXK2-PR14-R00 LXK2-PD12-Q00, LXK2-PD12-R00, LXK2-PD12-S00 LXK2-PH12-R00, LXK2-PH12-S00 LXK2-PL12-P00, LXK2-PL12-Q00, LXK2-PL12-R00 Source: www.luxeon.com KINGBRIGHT: KA-3528ASYC Source: www.kingbright.com
P1 P2 = con-headers-jp:M-2X14-: MALE HEADER
P3 P4 = con-headers-jp:M-2X09-: MALE HEADER
P5-P8 = monome-inc:EVJ-POT: audio pot
U1 = atmel-avr32:AT32UC3A0128/0256/0512: AT32UC3A0128/0256/0512
U2 = ftdi-chip:FT232RL: USB UART
U3 = memory-cypress:CY62167EV30-Z: SRAM 16-Mbit (1M x 16 / 2M x 8)
U4 = monome-inc:TPS2020
U5 = monome-inc:AD7923: ADC quad 12 bit
U6 = monome-inc:LM2678
U7 U8 = monome-inc:ADP3339
U9 = monome-inc:MT48LC16M16A2: SDRAM 4 Meg x 16 x 4 banks
U10 = diode:LM4040: VOLTAGE REFERENCE
U14 = monome-inc:AD1939
U17 = monome-inc:AD5686R: DAC quad 16 bit
U18 = monome-inc:FDS9431A
U19 = 74xx-us:74*14: Hex schmitt trigger INVERTER
U20 = monome-inc:SN74LVC2G14
U21 = monome-inc:LM2674
U22-U25 = diode:BAS70-04: Silicon Schottky Diodes General-purpose diode for high-speed switching
U$1 = monome-inc:PANASONIC-EVQ
U$2-U$5 = monome-inc:BOURNS-EM14
U$6 = monome-inc:SDMMC: SD MMC Card holder 4UCON part #06132 - easy to solder
U$10 = monome-inc:NHD-2.7
Y1 = crystal:CRYTAL: CRYSTAL
Y2 Y3 = crystal:ASFL1: CRYSTAL OSCILLATOR - Abracon